# Altium project google-coral-baseboard.PrjPcb
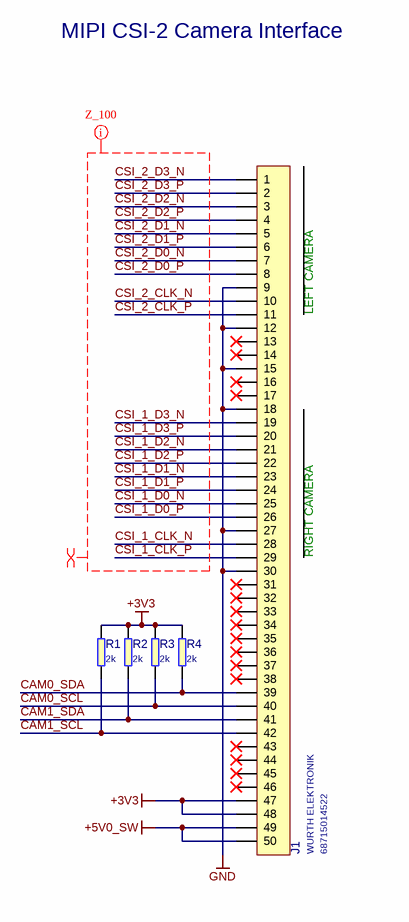
[diagram p0: CSI.SchDoc]
AM_Title: Google Coral Baseboard; AM_Status: OSHW; AM_Revision: 1.2
7 sheets, 284 parts. Net scope: global (net labels, ports and power ports of the same name join across sheets).
Board file: PCB.PcbDoc
Sheets:
  CSI.SchDoc
  Ethernet.SchDoc
  Interfaces.SchDoc
  M2.SchDoc
  SoM.SchDoc
  Supply.SchDoc
  USB-Debug.SchDoc

## Sheet CSI.SchDoc
size A3; SheetNumber: 1; SheetTotal: 1; PageSetup: Record=PageOptions|CenterHorizontal=True|CenterVertical=True|PrintScale=0.97|XCorrection=1.00|YCorrection=1.00|PrintKind=1|BorderSize=5000000|LeftOffset=0|BottomOffset=0|Orientation=2|PaperLength=2970|PaperWidth=2100|Scale=100|PaperSource=7|PrintQuality=600|MediaType=1|DitherType=10|PaperKind=A4|PrintScaleMode=1

### Parts
J1  68715014522  Manufacturer: WURTH ELEKTRONIK  [68715014522]
R1  2k  [0402]
R2  2k  [0402]
R3  2k  [0402]
R4  2k  [0402]

### Nets
+3V3: J1.47 J1.48 R1.1 R2.1 R3.1 R4.1
+5V0_SW: J1.49 J1.50
GND: J1.9 J1.12 J1.15 J1.18 J1.27 J1.30
CAM0_SCL: J1.40 R3.2
CAM0_SDA: J1.39 R4.2
CAM1_SCL: J1.42 R1.2
CAM1_SDA: J1.41 R2.2
CSI_1_CLK_N: J1.28
CSI_1_CLK_P: J1.29
CSI_1_D0_N: J1.25
CSI_1_D0_P: J1.26
CSI_1_D1_N: J1.23
CSI_1_D1_P: J1.24
CSI_1_D2_N: J1.21
CSI_1_D2_P: J1.22
CSI_1_D3_N: J1.19
CSI_1_D3_P: J1.20
CSI_2_CLK_N: J1.10
CSI_2_CLK_P: J1.11
CSI_2_D0_N: J1.7
CSI_2_D0_P: J1.8
CSI_2_D1_N: J1.5
CSI_2_D1_P: J1.6
CSI_2_D2_N: J1.3
CSI_2_D2_P: J1.4
CSI_2_D3_N: J1.1
CSI_2_D3_P: J1.2

Not connected (* = marked no-connect by the designer): J1 13* 14* 16* 17* 31* 32* 33* 34* 35* 36* 37* 38* 43* 44* 45* 46*

### Layout directives
net class Z_100: CSI_1_CLK_N, CSI_1_CLK_P, CSI_1_D0_N, CSI_1_D0_P, CSI_1_D1_N, CSI_1_D1_P, CSI_1_D2_N, CSI_1_D2_P, CSI_1_D3_N, CSI_1_D3_P, CSI_2_CLK_N, CSI_2_CLK_P, CSI_2_D0_N, CSI_2_D0_P, CSI_2_D1_N, CSI_2_D1_P, CSI_2_D2_N, CSI_2_D2_P, CSI_2_D3_N, CSI_2_D3_P
differential pair: CSI_1_CLK_N, CSI_1_CLK_P, CSI_1_D0_N, CSI_1_D0_P, CSI_1_D1_N, CSI_1_D1_P, CSI_1_D2_N, CSI_1_D2_P, CSI_1_D3_N, CSI_1_D3_P, CSI_2_CLK_N, CSI_2_CLK_P, CSI_2_D0_N, CSI_2_D0_P, CSI_2_D1_N, CSI_2_D1_P, CSI_2_D2_N, CSI_2_D2_P, CSI_2_D3_N, CSI_2_D3_P

### Notes on the sheet
- MIPI CSI-2 Camera Interface
- (near J1) LEFT CAMERA
- (near J1) RIGHT CAMERA
- Title:
- Size:
- Date:
- Status:
- A3
- Revision:
- Page:
- of
- Antmicro Ltd
- www.antmicro.com
- File:

### Library data of the parts
J1 = WE-687-150-145-22: 0.50mm SMT ZIF Horizontal Bottom Contact WR-FPC; Value: 68715014522; PartNumber: 68715014522
R1-R4 = R_2k_0402: SMT Resistor 2k 0402; PartNumber: R_2k_0402; Value: 2k

## Sheet Ethernet.SchDoc
size A3; SheetNumber: 1; SheetTotal: 1; PageSetup: Record=PageOptions|CenterHorizontal=True|CenterVertical=True|PrintScale=0.97|XCorrection=1.00|YCorrection=1.00|PrintKind=1|BorderSize=5000000|LeftOffset=0|BottomOffset=0|Orientation=2|PaperLength=2970|PaperWidth=2100|Scale=100|PaperSource=7|PrintQuality=600|MediaType=1|DitherType=10|PaperKind=A4|PrintScaleMode=1
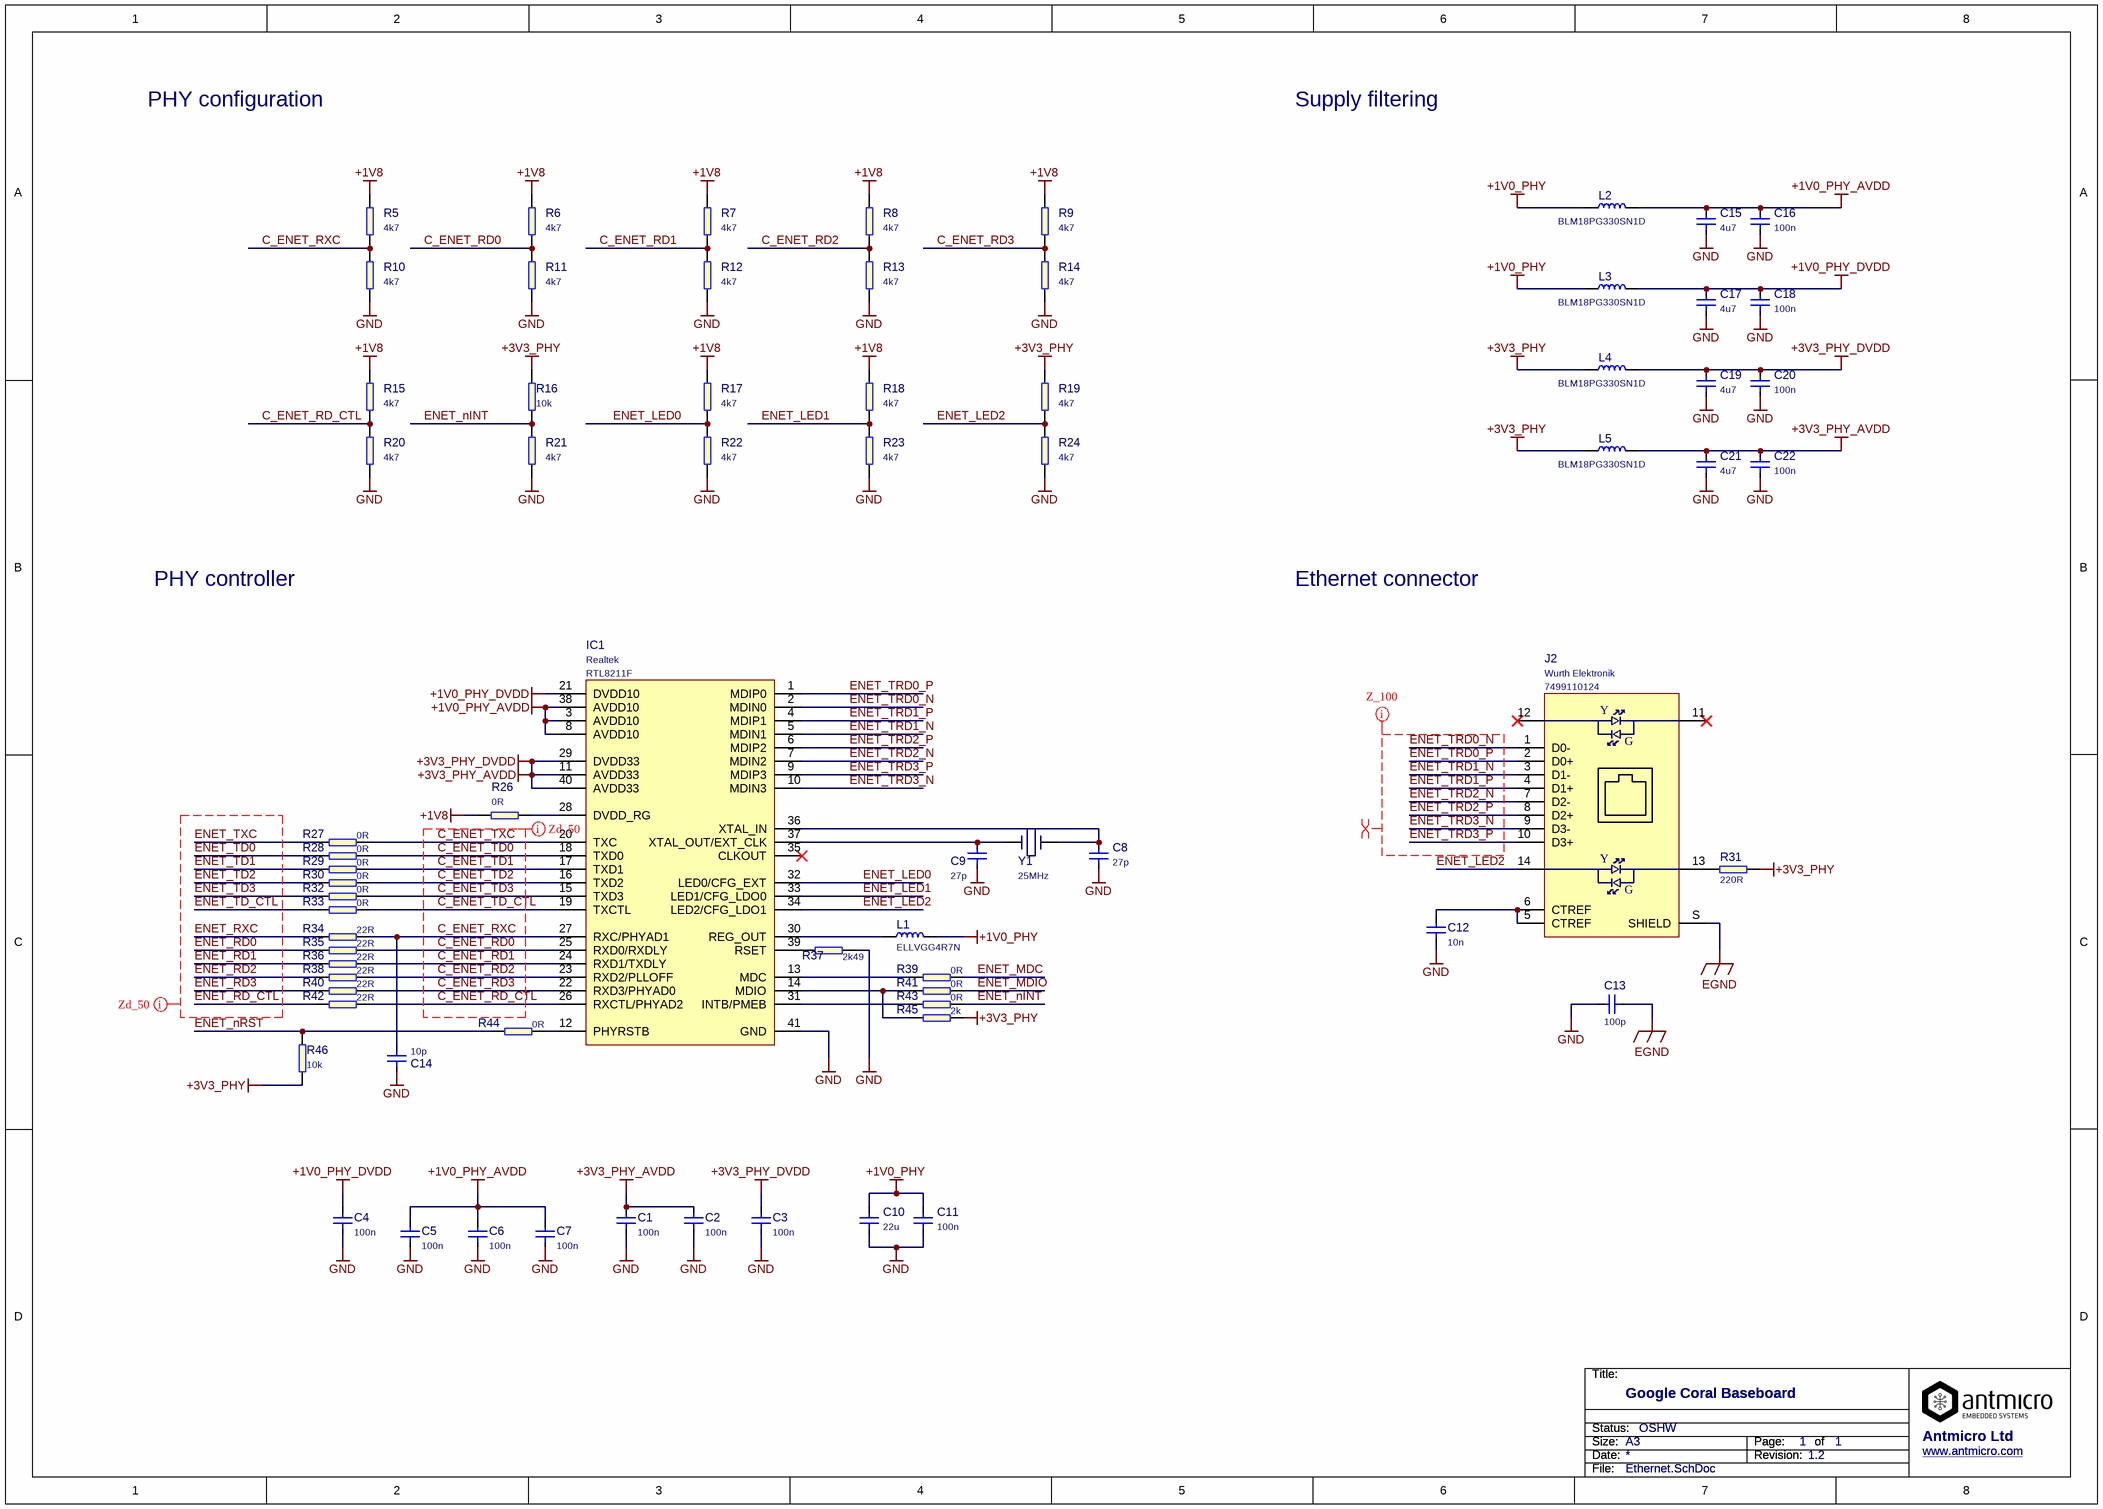
[diagram p1: Ethernet.SchDoc]

### Parts
C1  100n  [C_0402]
C2  100n  [C_0402]
C3  100n  [C_0402]
C4  100n  [C_0402]
C5  100n  [C_0402]
C6  100n  [C_0402]
C7  100n  [C_0402]
C8  27p  [C_0402]
C9  27p  [C_0402]
C10  22u  [1210]
C11  100n  [C_0402]
C12  10n  [0603]
C13  100p  [0603]
C14  10p  [C_0402]
C15  4u7  [0603]
C16  100n  [C_0402]
C17  4u7  [0603]
C18  100n  [C_0402]
C19  4u7  [0603]
C20  100n  [C_0402]
C21  4u7  [0603]
C22  100n  [C_0402]
IC1  RTL8211F  Manufacturer: Realtek  [RTL8211F]
J2  Manufacturer: Wurth Elektronik  [WE_7499110124]  (hidden comment: 7499110124)
L1  ELLVGG4R7N  [ELLVGG4R7N]
L2  BLM18PG330SN1D  [0603]
L3  BLM18PG330SN1D  [0603]
L4  BLM18PG330SN1D  [0603]
L5  BLM18PG330SN1D  [0603]
R5  4k7  [0402]
R6  4k7  [0402]
R7  4k7  [0402]
R8  4k7  [0402]
R9  4k7  [0402]
R10  4k7  [0402]
R11  4k7  [0402]
R12  4k7  [0402]
R13  4k7  [0402]
R14  4k7  [0402]
R15  4k7  [0402]
R16  10k  [0402]
R17  4k7  [0402]
R18  4k7  [0402]
R19  4k7  [0402]
R20  4k7  [0402]
R21  4k7  [0402]
R22  4k7  [0402]
R23  4k7  [0402]
R24  4k7  [0402]
R26  0R  [0402]
R27  0R  [0402]
R28  0R  [0402]
R29  0R  [0402]
R30  0R  [0402]
R31  220R  [0402]
R32  0R  [0402]
R33  0R  [0402]
R34  22R  [0402]
R35  22R  [0402]
R36  22R  [0402]
R37  2k49  [0603]
R38  22R  [0402]
R39  0R  [0402]
R40  22R  [0402]
R41  0R  [0402]
R42  22R  [0402]
R43  0R  [0402]
R44  0R  [0402]
R45  2k  [0402]
R46  10k  [0402]
Y1  25MHz  [TXC_7A]

### Nets
+1V0_PHY: C10.2 C11.2 L1.2 L2.1 L3.1
+1V0_PHY_AVDD: C5.2 C6.2 C7.2 C15.2 C16.2 IC1.3(AVDD10) IC1.8(AVDD10) IC1.38(AVDD10) L2.2
+1V0_PHY_DVDD: C4.2 C17.2 C18.2 IC1.21(DVDD10) L3.2
+1V8: R5.2 R6.2 R7.2 R8.2 R9.2 R15.2 R17.2 R18.2 R26.1
+3V3_PHY: L4.1 L5.1 R16.2 R19.2 R31.2 R45.2 R46.1
+3V3_PHY_AVDD: C1.2 C2.2 C3.2 C19.2 C20.2 C21.2 C22.2 IC1.11(AVDD33) IC1.29(DVDD33) IC1.40(AVDD33) L4.2 L5.2  [also labelled +3V3_PHY_DVDD]
EGND: C13.1 J2.S(SHIELD)
GND: C1.1 C2.1 C3.1 C4.1 C5.1 C6.1 C7.1 C8.1 C9.1 C10.1 C11.1 C12.1 C13.2 C14.1 C15.1 C16.1 C17.1 C18.1 C19.1 C20.1 C21.1 C22.1 IC1.41(GND) R10.1 R11.1 R12.1 R13.1 R14.1 R20.1 R21.1 R22.1 R23.1 R24.1 R37.2
C_ENET_RD0: IC1.25(RXD0/RXDLY) R6.1 R11.2 R35.2
C_ENET_RD1: IC1.24(RXD1/TXDLY) R7.1 R12.2 R36.2
C_ENET_RD2: IC1.23(RXD2/PLLOFF) R8.1 R13.2 R38.2
C_ENET_RD3: IC1.22(RXD3/PHYAD0) R9.1 R14.2 R40.2
C_ENET_RD_CTL: IC1.26(RXCTL/PHYAD2) R15.1 R20.2 R42.2
C_ENET_RXC: C14.2 IC1.27(RXC/PHYAD1) R5.1 R10.2 R34.2
C_ENET_TD0: IC1.18(TXD0) R28.2
C_ENET_TD1: IC1.17(TXD1) R29.2
C_ENET_TD2: IC1.16(TXD2) R30.2
C_ENET_TD3: IC1.15(TXD3) R32.2
C_ENET_TD_CTL: IC1.19(TXCTL) R33.2
C_ENET_TXC: IC1.20(TXC) R27.2
ENET_LED0: IC1.32(LED0/CFG_EXT) R17.1 R22.2
ENET_LED1: IC1.33(LED1/CFG_LDO0) R18.1 R23.2
ENET_LED2: IC1.34(LED2/CFG_LDO1) J2.14 R19.1 R24.2
ENET_MDC: R39.2
ENET_MDIO: R41.2
ENET_nINT: R16.1 R21.2 R43.2
ENET_nRST: R44.1 R46.2
ENET_RD0: R35.1
ENET_RD1: R36.1
ENET_RD2: R38.1
ENET_RD3: R40.1
ENET_RD_CTL: R42.1
ENET_RXC: R34.1
ENET_TD0: R28.1
ENET_TD1: R29.1
ENET_TD2: R30.1
ENET_TD3: R32.1
ENET_TD_CTL: R33.1
ENET_TRD0_N: IC1.2(MDIN0) J2.1(D0-)
ENET_TRD0_P: IC1.1(MDIP0) J2.2(D0+)
ENET_TRD1_N: IC1.5(MDIN1) J2.3(D1-)
ENET_TRD1_P: IC1.4(MDIP1) J2.4(D1+)
ENET_TRD2_N: IC1.7(MDIN2) J2.7(D2-)
ENET_TRD2_P: IC1.6(MDIP2) J2.8(D2+)
ENET_TRD3_N: IC1.10(MDIN3) J2.9(D3-)
ENET_TRD3_P: IC1.9(MDIP3) J2.10(D3+)
ENET_TXC: R27.1
NetC8_2: C8.2 IC1.36(XTAL_IN) Y1.2
NetC9_2: C9.2 IC1.37(XTAL_OUT/EXT_CLK) Y1.1
NetC12_2: C12.2 J2.5(CTREF) J2.6(CTREF)
NetIC1_12: IC1.12(PHYRSTB) R44.2
NetIC1_13: IC1.13(MDC) R39.1
NetIC1_14: IC1.14(MDIO) R41.1 R45.1
NetIC1_28: IC1.28(DVDD_RG) R26.2
NetIC1_30: IC1.30(REG_OUT) L1.1
NetIC1_31: IC1.31(INTB/PMEB) R43.1
NetIC1_39: IC1.39(RSET) R37.1
NetJ2_13: J2.13 R31.1

Not connected (* = marked no-connect by the designer): IC1 35(CLKOUT)*; J2 11* 12*

### Layout directives
net class Z_100: ENET_TRD0_N, ENET_TRD0_P, ENET_TRD1_N, ENET_TRD1_P, ENET_TRD2_N, ENET_TRD2_P, ENET_TRD3_N, ENET_TRD3_P
differential pair: ENET_TRD0_N, ENET_TRD0_P, ENET_TRD1_N, ENET_TRD1_P, ENET_TRD2_N, ENET_TRD2_P, ENET_TRD3_N, ENET_TRD3_P
net class Z_50: C_ENET_RD0, C_ENET_RD1, C_ENET_RD2, C_ENET_RD3, C_ENET_RD_CTL, C_ENET_RXC, C_ENET_TD0, C_ENET_TD1, C_ENET_TD2, C_ENET_TD3, C_ENET_TD_CTL, C_ENET_TXC, ENET_RD0, ENET_RD1, ENET_RD2, ENET_RD3, ENET_RD_CTL, ENET_RXC, ENET_TD0, ENET_TD1, ENET_TD2, ENET_TD3, ENET_TD_CTL, ENET_TXC

### Notes on the sheet
- PHY configuration
- Supply filtering
- PHY controller
- Ethernet connector
- Title:
- Size:
- Date:
- Status:
- A3
- Revision:
- Page:
- of
- Antmicro Ltd
- www.antmicro.com
- File:
- (in symbol WE_7499110124) Y; G

### Library data of the parts
C1-C7 C11 C16 C18 C20 C22 = C_100n_0402: MLCC SMT Capacitor 100nF 0402; PartNumber: C_100n_0402; Value: 100n
C8 C9 = C_27p_0402: MLCC SMT Capacitor 27pF 0402; PartNumber: C_27p_0402; Value: 27p
C10 = C_22u_1210: MLCC SMT Capacitor 22uF 1210; PartNumber: C_22u_1210; Value: 22u
C12 = C_10n_0603: MLCC SMT Capacitor 10nF 0603; PartNumber: C_10n_0603; Value: 10n
C13 = C_100p_0603: MLCC SMT Capacitor 100pF 0603; PartNumber: C_100p_0603; Value: 100p
C14 = C_10p_0402: MLCC SMT Capacitor 10pF 0402; PartNumber: C_10p_0402; Value: 10p
C15 C17 C19 C21 = C_4u7_0603: MLCC SMT Capacitor 4u7F 0603; PartNumber: C_4u7_0603; Value: 4u7
IC1 = RTL8211F: Highly Integrated 10/100/1000m Ethernet Transceiver; PartNumber: RTL8211F; Value: RTL8211F
J2 = WE_7499110124: LAN-Transformer WE-RJ45LAN 10/100/1000 BaseT; PartNumber: 7499110124; Value: 7499110124
L1 = ELLVGG4R7N: PANASONIC ELECTRONIC COMPONENTS  ELLVGG4R7N  Surface Mount Power Inductor, Choke Coil, ELL-VGG Series, 4.7 ?H, ? 30%, Shielded, 0.17 ohm, 980 mA; Manufacturer: PANASONIC ELECTRONIC COMPONENTS / ELLVGG4R7N / PANASONIC ELECTRONIC COMPONENTS; PartNumber: ELLVGG4R7N; Value: ELLVGG4R7N
L2-L5 = BLM18PG330SN1D: MURATA 	BLM18PG330SN1D  FERRITE BEAD, 0.025OHM, 3A, 0603; Value: BLM18PG330SN1D; Manufacturer: MURATA; PartNumber: BLM18PG330SN1D
R5-R15 R17-R24 = R_4k7_0402: SMT Resistor 4k7 0402; PartNumber: R_4k7_0402; Value: 4k7
R16 R46 = R_10k_0402: SMT Resistor 0402; PartNumber: R_10k_0402; Value: 10k
R26-R30 R32 R33 R39 R41 R43 R44 = R_0R_0402: SMT Resistor 0402; PartNumber: R_0R_0402; Value: 0R
R31 = R_220R_0402: SMT Resistor 220R 0402; PartNumber: R_220R_0402; Value: 220R
R34-R36 R38 R40 R42 = R_22R_0402: SMT Resistor 22R 0402; PartNumber: R_22R_0402; Value: 22R
R37 = R_2k49_0603_1%: SMT Resistor 2k49 0603 1%; PartNumber: R_2k49_0603_1%; Value: 2k49
R45 = R_2k_0402: SMT Resistor 2k 0402; PartNumber: R_2k_0402; Value: 2k
Y1 = CRYSTAL_25MHz_SMD_TXC: CRYSTAL, 25.000MHZ; Manufacturer: TXC; Value: 25MHz; PartNumber: CRYSTAL_25MHz_SMD_TXC

## Sheet Interfaces.SchDoc
size A3; SheetNumber: 1; SheetTotal: 1; PageSetup: Record=PageOptions|CenterHorizontal=True|CenterVertical=True|PrintScale=0.97|XCorrection=1.00|YCorrection=1.00|PrintKind=1|BorderSize=5000000|LeftOffset=0|BottomOffset=0|Orientation=2|PaperLength=2970|PaperWidth=2100|Scale=100|PaperSource=7|PrintQuality=600|MediaType=1|DitherType=10|PaperKind=A4|PrintScaleMode=1
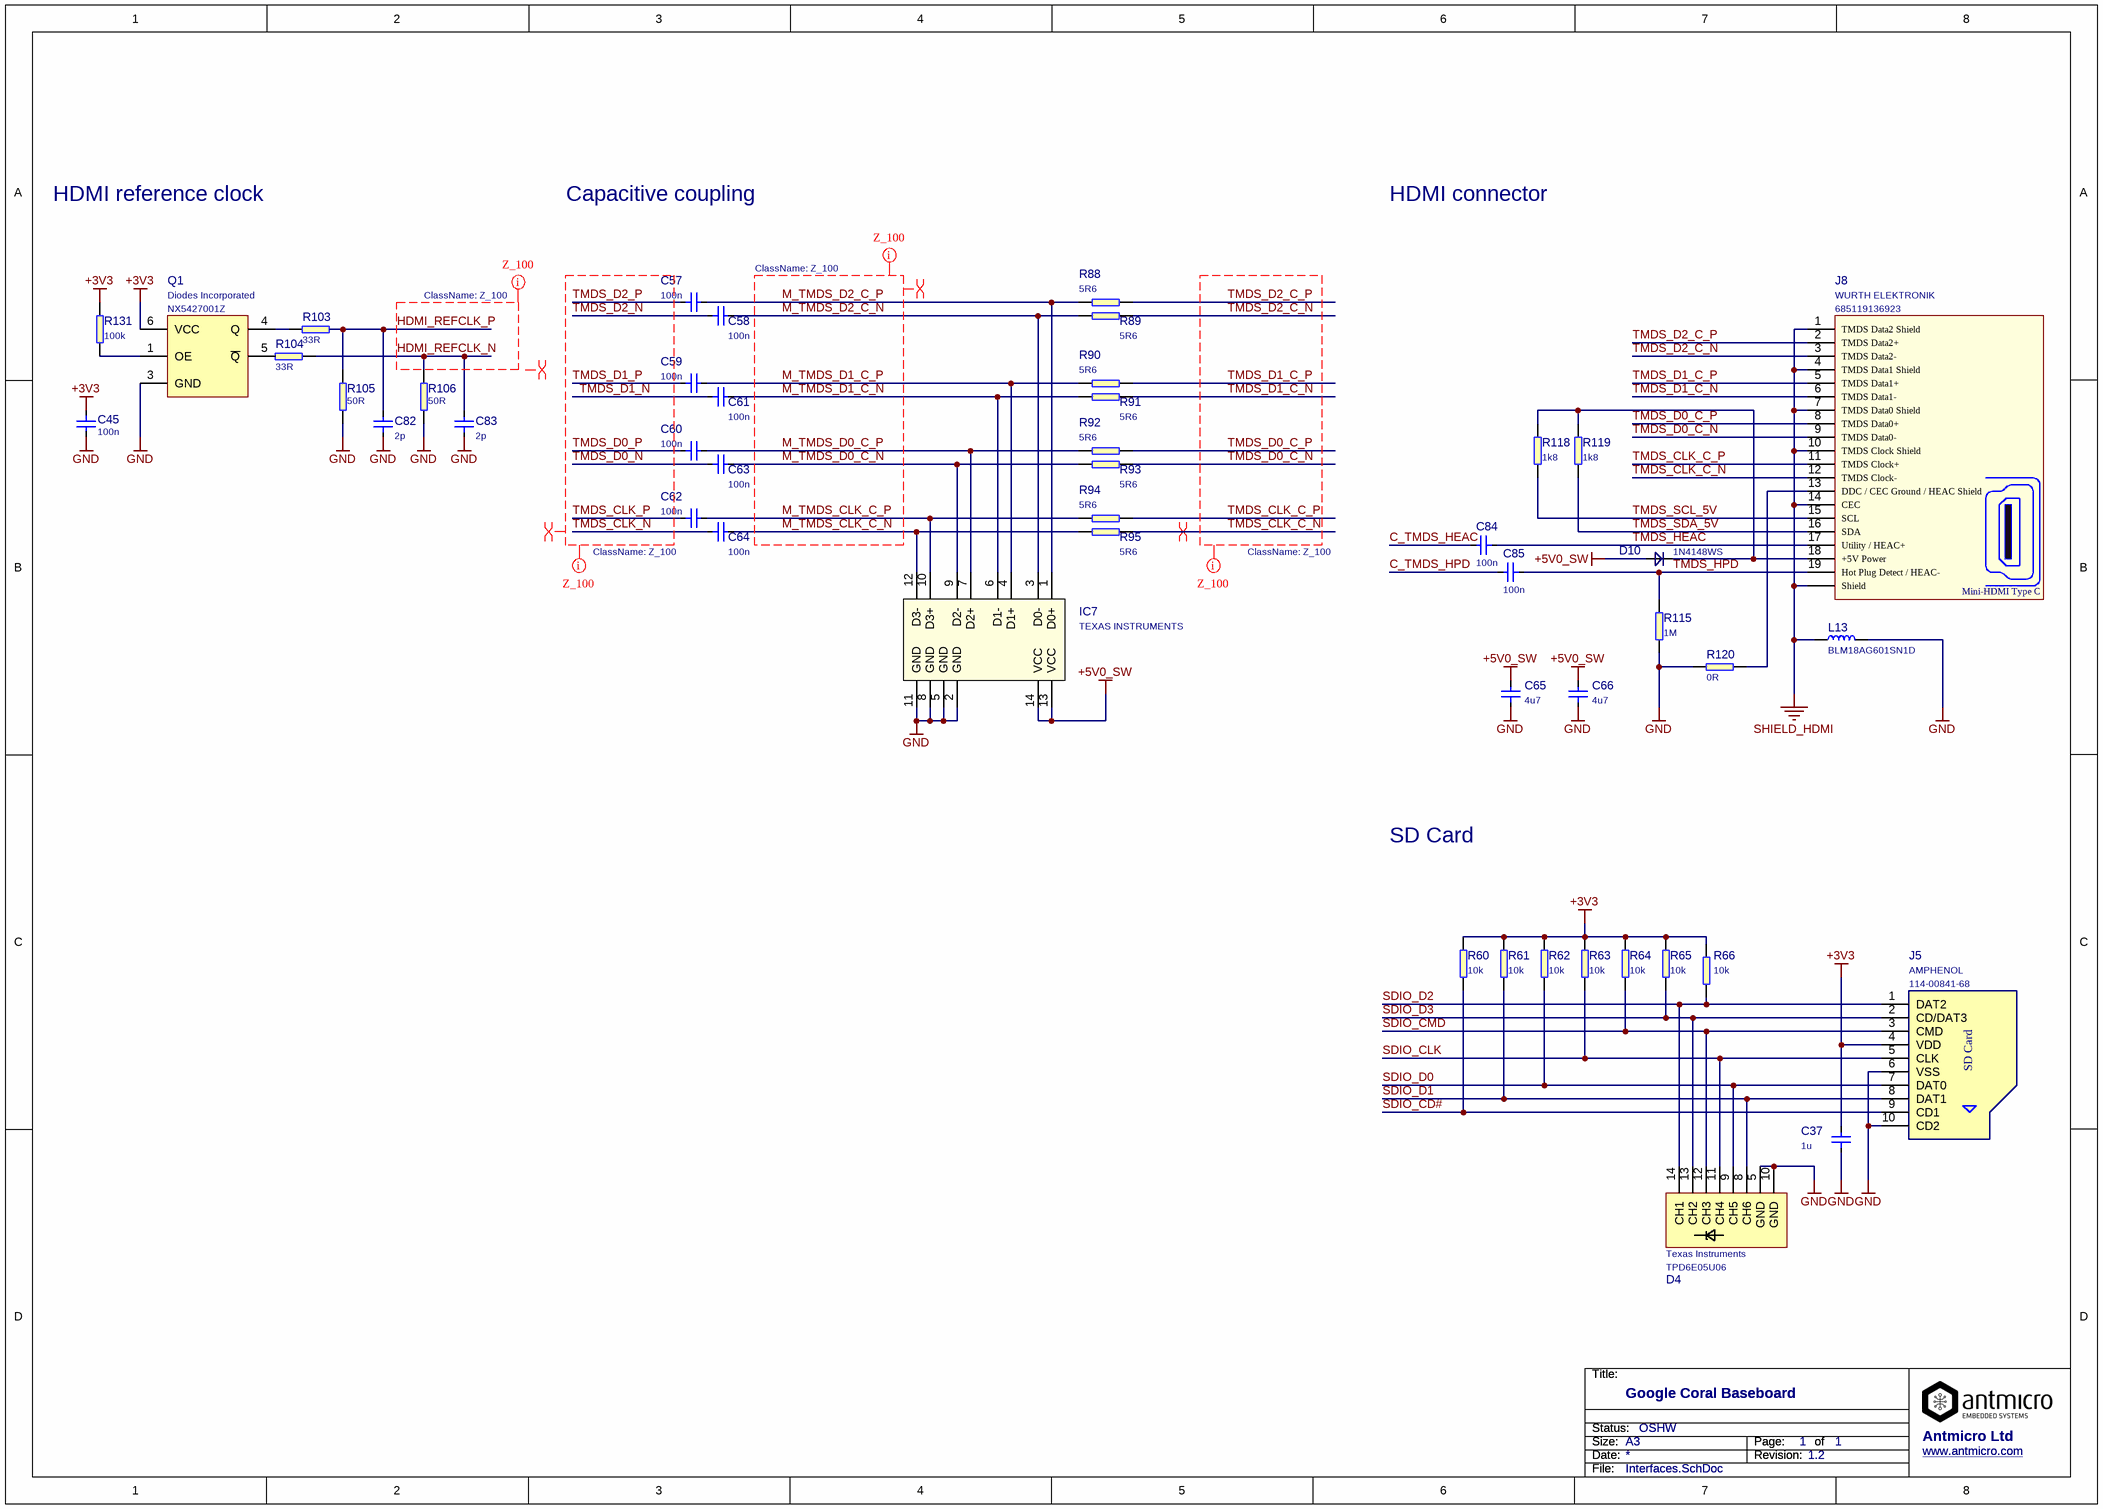
[diagram p2: Interfaces.SchDoc]

### Parts
C37  1u  [0603]
C45  100n  [C_0402]
C57  100n  [C_0402]
C58  100n  [C_0402]
C59  100n  [C_0402]
C60  100n  [C_0402]
C61  100n  [C_0402]
C62  100n  [C_0402]
C63  100n  [C_0402]
C64  100n  [C_0402]
C65  4u7  [C_0402]
C66  4u7  [C_0402]
C82  2p  [C_0402]
C83  2p  [C_0402]
C84  100n  [C_0402]
C85  100n  [C_0402]
D4  Manufacturer: Texas Instruments  [TPD6E05U06_PASS]  (hidden comment: TPD6E05U06)
D10  1N4148WS  [SOD-323]
IC7  Manufacturer: TEXAS INSTRUMENTS  [SON-15]  (hidden comment: TPD8S009)
J5  Manufacturer: AMPHENOL  [114-00841-68]  (hidden comment: 114-00841-68)
J8  685119136923  Manufacturer: WURTH ELEKTRONIK  [WE_685119136923]
L13  BLM18AG601SN1D  [0603]
Q1  Manufacturer: Diodes Incorporated  [NX5427001Z]  (hidden comment: NX5427001Z)
R60  10k  [0402]
R61  10k  [0402]
R62  10k  [0402]
R63  10k  [0402]
R64  10k  [0402]
R65  10k  [0402]
R66  10k  [0402]
R88  5R6  [0402]
R89  5R6  [0402]
R90  5R6  [0402]
R91  5R6  [0402]
R92  5R6  [0402]
R93  5R6  [0402]
R94  5R6  [0402]
R95  5R6  [0402]
R103  33R  [0402]
R104  33R  [0402]
R105  50R  [0402]
R106  50R  [0402]
R115  1M  [0402]
R118  1k8  [0603]
R119  1k8  [0603]
R120  0R  [0402]
R131  100k  [0402]

### Nets
+3V3: C37.2 C45.1 J5.4(VDD) Q1.6(VCC) R60.2 R61.2 R62.2 R63.2 R64.2 R65.2 R66.2 R131.2
+5V0_SW: C65.2 C66.2 D10.A IC7.13(VCC) IC7.14(VCC)
GND: C37.1 C45.2 C65.1 C66.1 C82.1 C83.1 D4.5(GND) D4.10(GND) IC7.2(GND) IC7.5(GND) IC7.8(GND) IC7.11(GND) J5.6(VSS) J5.10(CD2) L13.2 Q1.3(GND) R105.1 R106.1 R115.1 R120.1
SHIELD_HDMI: J8.1(TMDS_Data2_Shield) J8.4(TMDS_Data1_Shield) J8.7(TMDS_Data0_Shield) J8.10(TMDS_Clock_Shield) J8.14(CEC) J8.Shell(Shield) L13.1
C_TMDS_HEAC: C84.2
C_TMDS_HPD: C85.2
HDMI_REFCLK_N: C83.2 R104.2 R106.2
HDMI_REFCLK_P: C82.2 R103.2 R105.2
M_TMDS_CLK_C_N: C64.2 IC7.12(D3-) R95.1
M_TMDS_CLK_C_P: C62.2 IC7.10(D3+) R94.1
M_TMDS_D0_C_N: C63.2 IC7.9(D2-) R93.1
M_TMDS_D0_C_P: C60.2 IC7.7(D2+) R92.1
M_TMDS_D1_C_N: C61.2 IC7.6(D1-) R91.1
M_TMDS_D1_C_P: C59.2 IC7.4(D1+) R90.1
M_TMDS_D2_C_N: C58.2 IC7.3(D0-) R89.1
M_TMDS_D2_C_P: C57.2 IC7.1(D0+) R88.1
SDIO_CD#: J5.9(CD1) R60.1
SDIO_CLK: D4.11(CH4) J5.5(CLK) R63.1
SDIO_CMD: D4.12(CH3) J5.3(CMD) R64.1
SDIO_D0: D4.9(CH5) J5.7(DAT0) R62.1
SDIO_D1: D4.8(CH6) J5.8(DAT1) R61.1
SDIO_D2: D4.14(CH1) J5.1(DAT2) R66.1
SDIO_D3: D4.13(CH2) J5.2(CD/DAT3) R65.1
TMDS_CLK_C_N: J8.12(TMDS_Clock-) R95.2
TMDS_CLK_C_P: J8.11(TMDS_Clock+) R94.2
TMDS_CLK_N: C64.1
TMDS_CLK_P: C62.1
TMDS_D0_C_N: J8.9(TMDS_Data0-) R93.2
TMDS_D0_C_P: J8.8(TMDS_Data0+) R92.2
TMDS_D0_N: C63.1
TMDS_D0_P: C60.1
TMDS_D1_C_N: J8.6(TMDS_Data1-) R91.2
TMDS_D1_C_P: J8.5(TMDS_Data1+) R90.2
TMDS_D1_N: C61.1
TMDS_D1_P: C59.1
TMDS_D2_C_N: J8.3(TMDS_Data2-) R89.2
TMDS_D2_C_P: J8.2(TMDS_Data2+) R88.2
TMDS_D2_N: C58.1
TMDS_D2_P: C57.1
TMDS_HEAC: C84.1 J8.17(Utility_/_HEAC+)
TMDS_HPD: C85.1 J8.19(Hot_Plug_Detect_/_HEAC-) R115.2
TMDS_SCL_5V: J8.15(SCL) R118.1
TMDS_SDA_5V: J8.16(SDA) R119.1
NetD10_C: D10.C J8.18(+5V_Power) R118.2 R119.2
NetJ8_13: J8.13(DDC_/_CEC_Ground_/_HEAC_Shield) R120.2
NetQ1_1: Q1.1(OE) R131.1
NetQ1_4: Q1.4(Q) R103.1
NetQ1_5: Q1.5(~{Q}) R104.1

### Layout directives
net class Z_100: HDMI_REFCLK_N, HDMI_REFCLK_P, M_TMDS_CLK_C_N, M_TMDS_CLK_C_P, M_TMDS_D0_C_N, M_TMDS_D0_C_P, M_TMDS_D1_C_N, M_TMDS_D1_C_P, M_TMDS_D2_C_N, M_TMDS_D2_C_P, TMDS_CLK_C_N, TMDS_CLK_C_P, TMDS_CLK_N, TMDS_CLK_P, TMDS_D0_C_N, TMDS_D0_C_P, TMDS_D0_N, TMDS_D0_P, TMDS_D1_C_N, TMDS_D1_C_P, TMDS_D1_N, TMDS_D1_P, TMDS_D2_C_N, TMDS_D2_C_P, TMDS_D2_N, TMDS_D2_P
differential pair: (no net found under the mark), M_TMDS_CLK_C_N, M_TMDS_CLK_C_P, M_TMDS_D0_C_N, M_TMDS_D0_C_P, M_TMDS_D1_C_N, M_TMDS_D1_C_P, M_TMDS_D2_C_N, M_TMDS_D2_C_P, TMDS_CLK_C_N, TMDS_CLK_N, TMDS_CLK_P, TMDS_D0_N, TMDS_D0_P, TMDS_D1_N, TMDS_D1_P, TMDS_D2_N, TMDS_D2_P

### Notes on the sheet
- HDMI reference clock
- Capacitive coupling
- HDMI connector
- SD Card
- Title:
- Size:
- Date:
- Status:
- A3
- Revision:
- Page:
- of
- Antmicro Ltd
- www.antmicro.com
- File:
- (in symbol AMP-114-00841-68) SD Card
- (in symbol WE_685119136923) Mini-HDMI Type C

### Library data of the parts
C37 = C_1u_0603: MLCC SMT Capacitor 1uF 0603; Value: 1u; PartNumber: C_1u_0603
C45 C57-C64 C84 C85 = C_100n_0402: MLCC SMT Capacitor 100nF 0402; PartNumber: C_100n_0402; Value: 100n
C65 C66 = C_4u7_0402: MLCC SMT Capacitor 4u7F 0402; PartNumber: C_4u7_0402; Value: 4u7
C82 C83 = C_2p_0402: MLCC SMT Capacitor 2p 0402; PartNumber: C_2p_0402; Value: 2p
D4 = TPD6E05U06_PASS: ESD Suppressors 6-CH Pass through layout; Value: TPD6E05U06; PartNumber: TPD6E05U06
D10 = 1N4148WS: Diode small signal; Manufacturer: MULTICOMP; Value: 1N4148WS; PartNumber: 1N4148WS
IC7 = TPD8S009: 8-Channel ESD Protection for DisplayPort and HDMI; PartNumber: TPD8S009; Value: TPD8S009
J5 = AMP-114-00841-68: Micro SD card holder; Value: 114-00841-68; PartNumber: 114-00841-68
J8 = WE_685119136923: CONN HDMI FEMALE R/A 19POS 2.6MM; PartNumber: WE_685119136923; Value: 685119136923
L13 = BLM18AG601SN1D: Ferrite Bead, 600 ohm, 0603 [1608 Metric], BLM18A Series, 500 mA, 0.38 ohm, ? 25%; Manufacturer: MURATA; PartNumber: BLM18AG601SN1D; Value: BLM18AG601SN1D
Q1 = NX5427001Z: CLOCK SAW OSCILLATOR SEAM5032; PartNumber: NX5427001Z; Value: NX5427001Z
R60-R66 = R_10k_0402: SMT Resistor 0402; Value: 10k; PartNumber: R_10k_0402
R88-R95 = R_5R6_0402: SMD Resistor 0402; PartNumber: R_5R6_0402; Value: 5R6
R103 R104 = R_33R_0402: RES, 33R, 0402, 1%; PartNumber: R_33R_0402; Value: 33R
R105 R106 = R_33R_0402: RES, 33R, 0402, 1%; PartNumber: R_50R_0402; Value: 50R
R115 = R_1M_0402: SMT Resistor 1M 0402; PartNumber: R_1M_0402; Value: 1M
R118 R119 = R_1k8_0603: SMT Resistor 1k8 0603; PartNumber: R_1k8_0603; Value: 1k8
R120 = R_0R_0402: SMT Resistor 0402; PartNumber: R_0R_0402; Value: 0R
R131 = R_100k_0402: SMT Resistor 100k 0402; PartNumber: R_100k_0402; Value: 100k

## Sheet M2.SchDoc
size A3; SheetNumber: 1; SheetTotal: 1; PageSetup: Record=PageOptions|CenterHorizontal=True|CenterVertical=True|PrintScale=0.97|XCorrection=1.00|YCorrection=1.00|PrintKind=1|BorderSize=5000000|LeftOffset=0|BottomOffset=0|Orientation=2|PaperLength=2970|PaperWidth=2100|Scale=100|PaperSource=7|PrintQuality=600|MediaType=1|DitherType=10|PaperKind=A4|PrintScaleMode=1
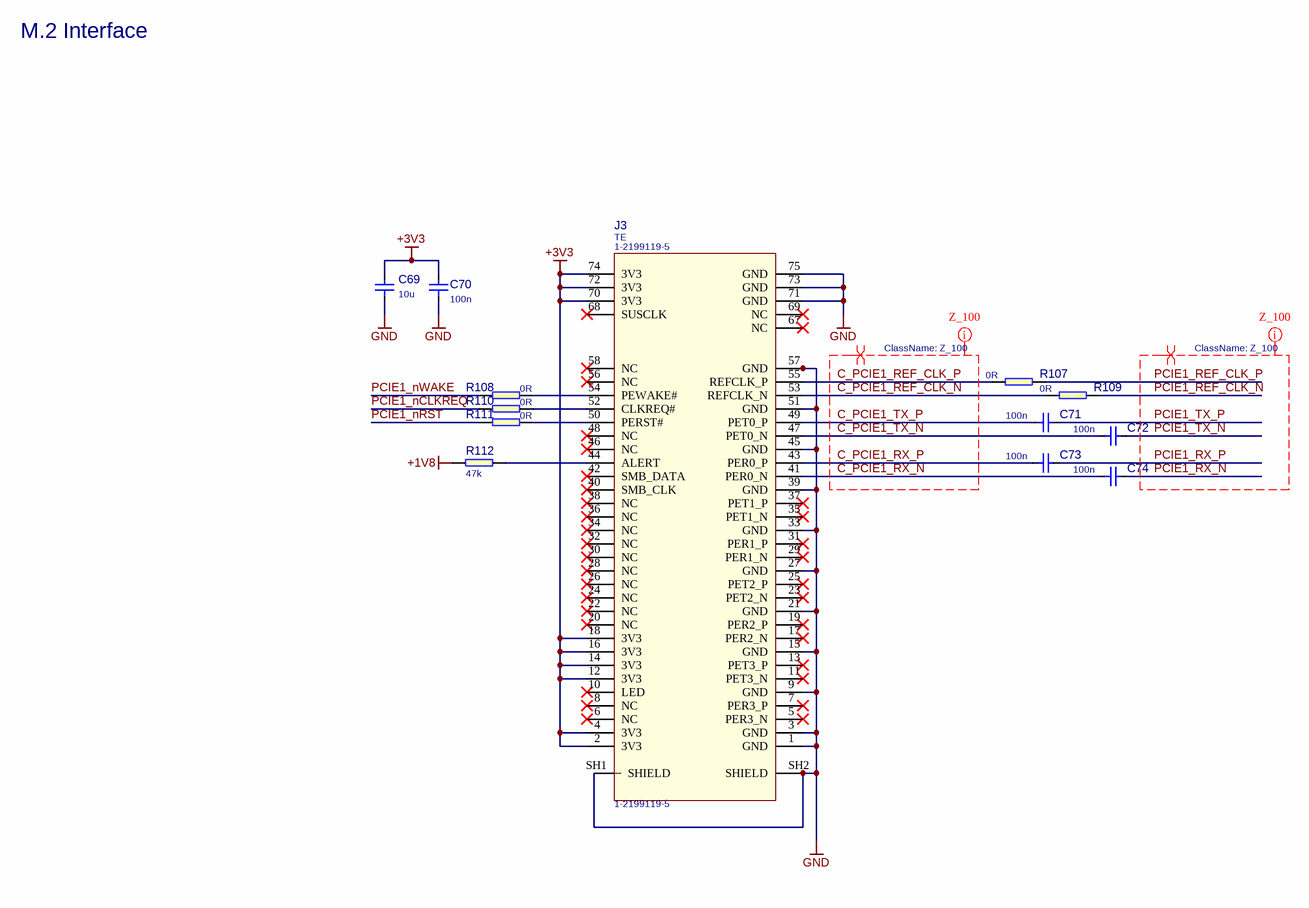
[diagram p3: M2.SchDoc]

### Parts
C69  10u  [0805]
C70  100n  [C_0402]
C71  100n  [C_0402]
C72  100n  [C_0402]
C73  100n  [C_0402]
C74  100n  [C_0402]
J3  1-2199119-5  Manufacturer: TE  [1-2199119-5]
R107  0R  [0402]
R108  0R  [0402]
R109  0R  [0402]
R110  0R  [0402]
R111  0R  [0402]
R112  47k  [0402]

### Nets
+1V8: R112.2
+3V3: C69.2 C70.2 J3.2(3V3) J3.4(3V3) J3.12(3V3) J3.14(3V3) J3.16(3V3) J3.18(3V3) J3.70(3V3) J3.72(3V3) J3.74(3V3)
GND: C69.1 C70.1 J3.1(GND) J3.3(GND) J3.9(GND) J3.15(GND) J3.21(GND) J3.27(GND) J3.33(GND) J3.39(GND) J3.45(GND) J3.51(GND) J3.57(GND) J3.71(GND) J3.73(GND) J3.75(GND) J3.SH1(SHIELD) J3.SH2(SHIELD)
C_PCIE1_REF_CLK_N: J3.53(REFCLK_N) R109.1
C_PCIE1_REF_CLK_P: J3.55(REFCLK_P) R107.1
C_PCIE1_RX_N: C74.1 J3.41(PER0_N)
C_PCIE1_RX_P: C73.1 J3.43(PER0_P)
C_PCIE1_TX_N: C72.1 J3.47(PET0_N)
C_PCIE1_TX_P: C71.1 J3.49(PET0_P)
PCIE1_nCLKREQ: R110.1
PCIE1_nRST: R111.1
PCIE1_nWAKE: R108.1
PCIE1_REF_CLK_N: R109.2
PCIE1_REF_CLK_P: R107.2
PCIE1_RX_N: C74.2
PCIE1_RX_P: C73.2
PCIE1_TX_N: C72.2
PCIE1_TX_P: C71.2
NetJ3_44: J3.44(ALERT) R112.1
NetJ3_50: J3.50(PERST#) R111.2
NetJ3_52: J3.52(CLKREQ#) R110.2
NetJ3_54: J3.54(PEWAKE#) R108.2

Not connected (* = marked no-connect by the designer): J3 5(PER3_N)* 6(NC)* 7(PER3_P)* 8(NC)* 10(LED)* 11(PET3_N)* 13(PET3_P)* 17(PER2_N)* 19(PER2_P)* 20(NC)* 22(NC)* 23(PET2_N)* 24(NC)* 25(PET2_P)* 26(NC)* 28(NC)* 29(PER1_N)* 30(NC)* 31(PER1_P)* 32(NC)* 34(NC)* 35(PET1_N)* 36(NC)* 37(PET1_P)* 38(NC)* 40(SMB_CLK)* 42(SMB_DATA)* 46(NC)* 48(NC)* 56(NC)* 58(NC)* 67(NC)* 68(SUSCLK)* 69(NC)*

### Layout directives
net class Z_100: C_PCIE1_REF_CLK_N, C_PCIE1_REF_CLK_P, C_PCIE1_RX_N, C_PCIE1_RX_P, C_PCIE1_TX_N, C_PCIE1_TX_P, PCIE1_REF_CLK_N, PCIE1_REF_CLK_P, PCIE1_RX_N, PCIE1_RX_P, PCIE1_TX_N, PCIE1_TX_P
differential pair: C_PCIE1_REF_CLK_N, C_PCIE1_REF_CLK_P, C_PCIE1_RX_N, C_PCIE1_RX_P, C_PCIE1_TX_N, C_PCIE1_TX_P, PCIE1_REF_CLK_N, PCIE1_REF_CLK_P, PCIE1_RX_N, PCIE1_RX_P, PCIE1_TX_N, PCIE1_TX_P

### Notes on the sheet
- M.2 Interface
- Title:
- Size:
- Date:
- Status:
- A3
- Revision:
- Page:
- of
- Antmicro Ltd
- www.antmicro.com
- File:

### Library data of the parts
C69 = C_10u_0805: MLCC SMT Capacitor 10uF 0805; PartNumber: C_10u_0805; Value: 10u
C70-C74 = C_100n_0402: MLCC SMT Capacitor 100nF 0402; PartNumber: C_100n_0402; Value: 100n
J3 = 1-2199119-5: CONN FEMALE 67POS 0.020 GOLD; PartNumber: 1-2199119-5; Value: 1-2199119-5
R107-R111 = R_0R_0402: SMT Resistor 0402; PartNumber: R_0R_0402; Value: 0R
R112 = R_47k_0402: SMT Resistor 0402; PartNumber: R_47k_0402; Value: 47k

## Sheet SoM.SchDoc
size A3; SheetNumber: 1; SheetTotal: 1; PageSetup: Record=PageOptions|CenterHorizontal=True|CenterVertical=True|PrintScale=0.97|XCorrection=1.00|YCorrection=1.00|PrintKind=1|BorderSize=5000000|LeftOffset=0|BottomOffset=0|Orientation=2|PaperLength=2970|PaperWidth=2100|Scale=100|PaperSource=7|PrintQuality=600|MediaType=1|DitherType=10|PaperKind=A4|PrintScaleMode=1
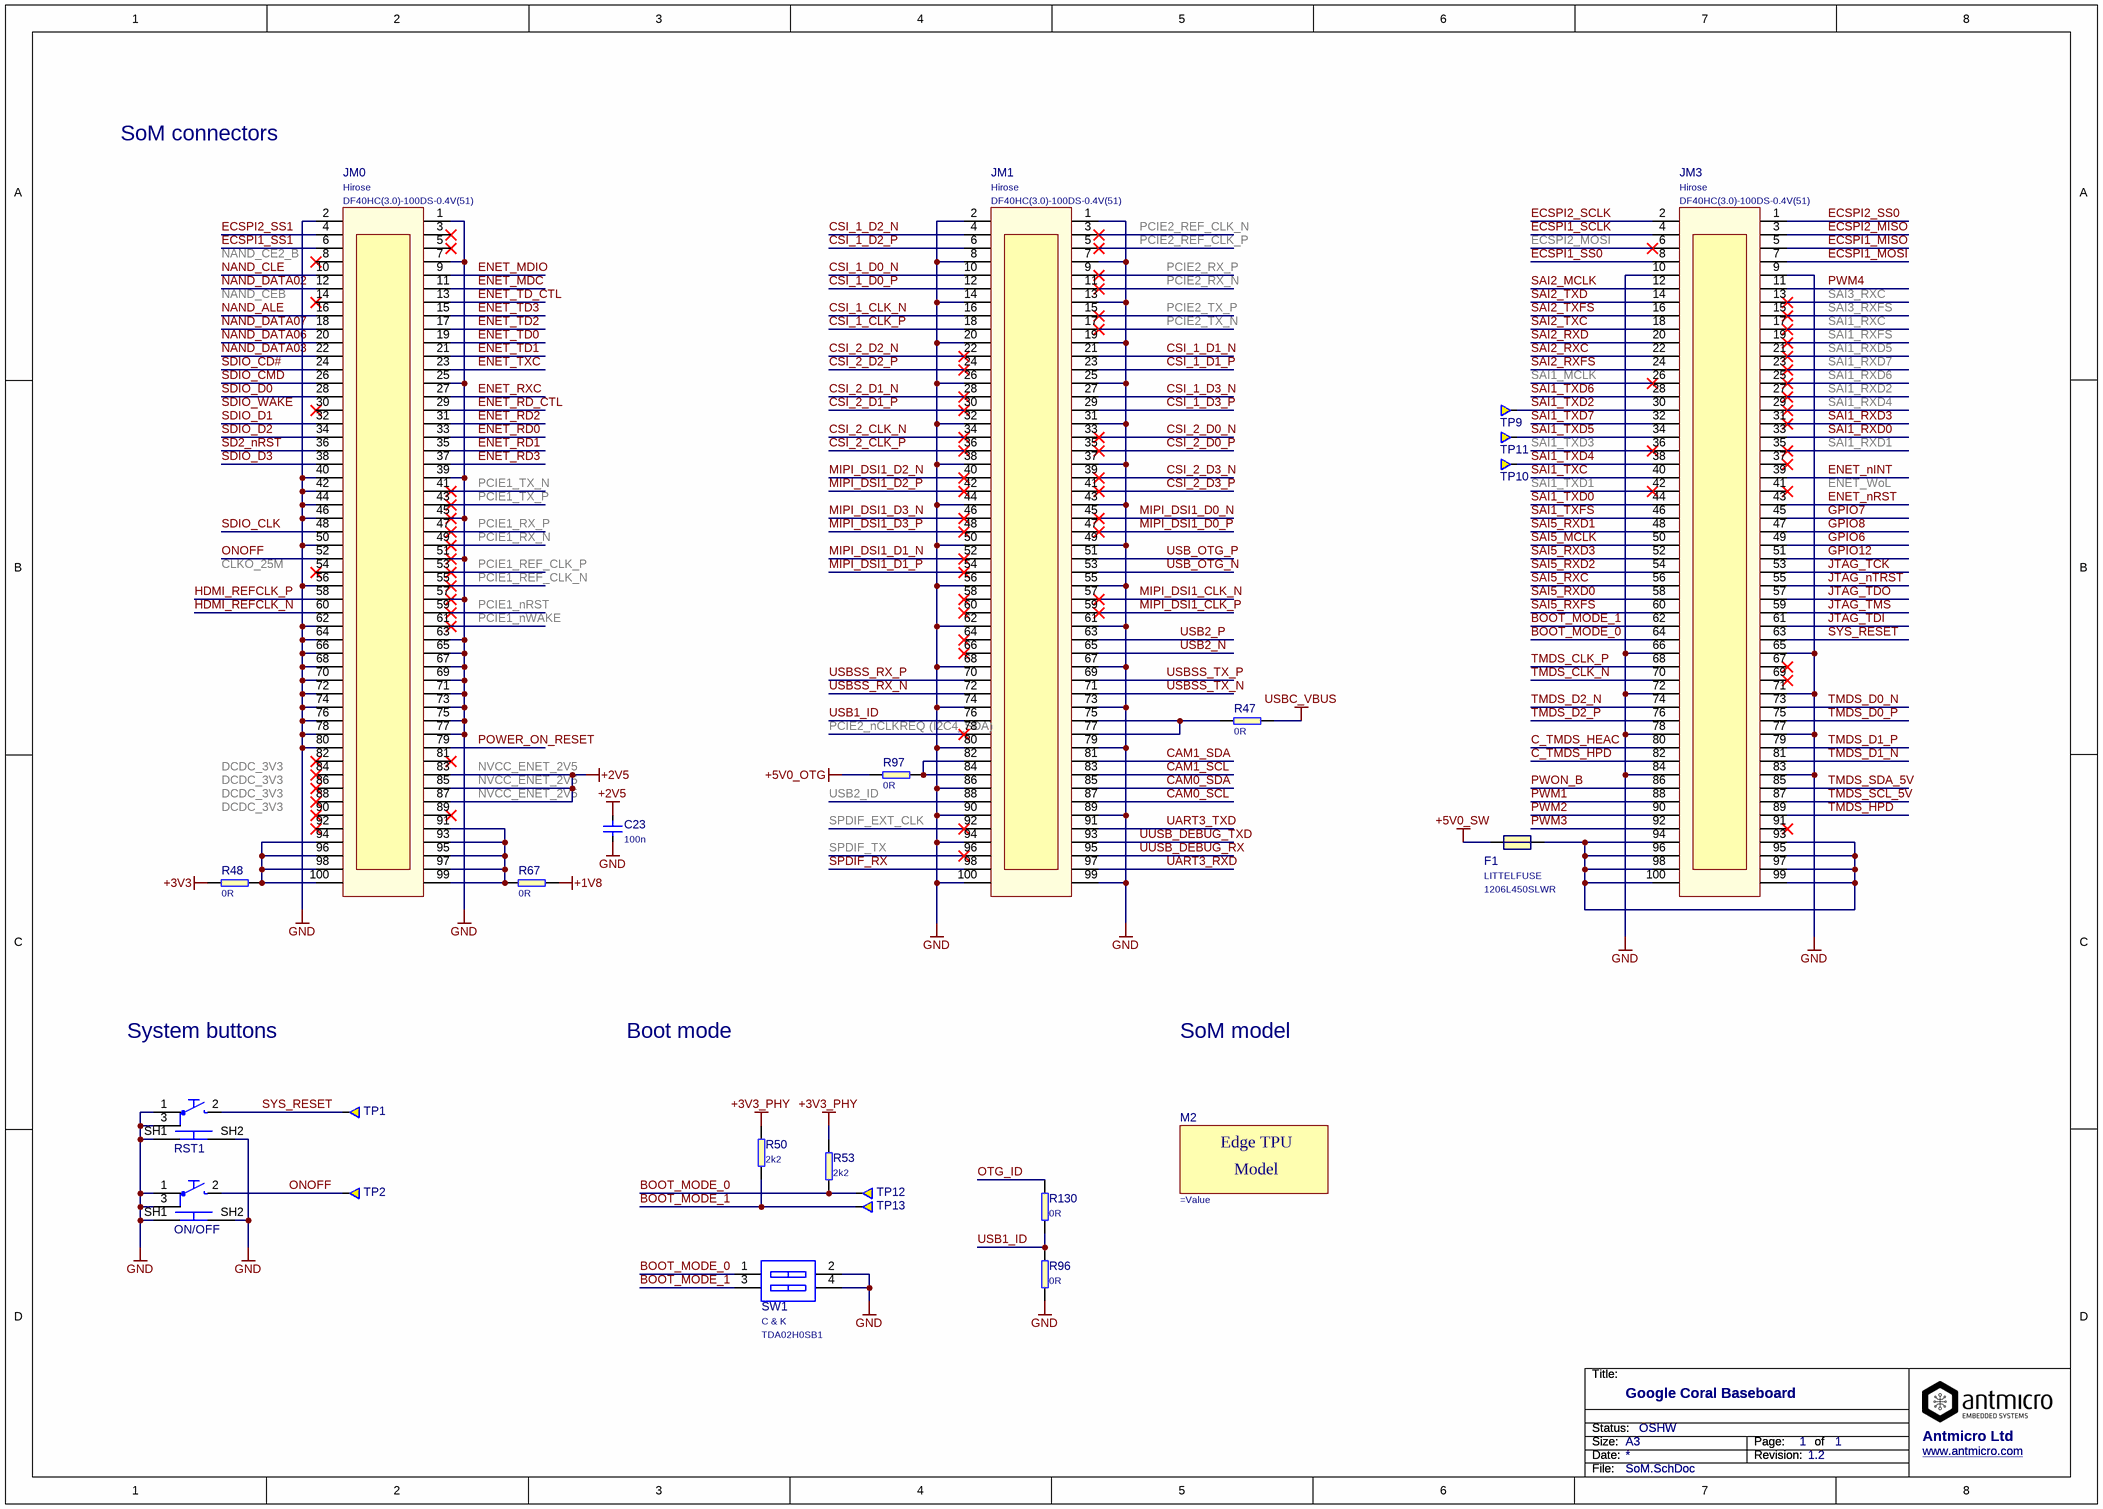
[diagram p4: SoM.SchDoc]

### Parts
C23  100n  [C_0402]
F1  PartNumber: 1206L450SLWR  Manufacturer: LITTELFUSE  [Fuse-1206]  (hidden comment: Value)
JM0  DF40HC(3.0)-100DS-0.4V(51)  Manufacturer: Hirose  [DF40HC(3.0)-100DS-0.4V(51)]
JM1  DF40HC(3.0)-100DS-0.4V(51)  Manufacturer: Hirose  [DF40HC(3.0)-100DS-0.4V(51)]
JM3  DF40HC(3.0)-100DS-0.4V(51)  Manufacturer: Hirose  [DF40HC(3.0)-100DS-0.4V(51)]
M2  (no value)  [Edge-TPU-SOM-model]
ON/OFF  TL3340AF160QG  [TL3340AF160QG]  (value not drawn)
R47  0R  [0402]
R48  0R  [0805]
R50  2k2  [0402]
R53  2k2  [0402]
R67  0R  [0805]
R96  0R  [0402]
R97  0R  [0402]
R130  0R  [0402]
RST1  TL3340AF160QG  [TL3340AF160QG]  (value not drawn)
SW1  TDA02H0SB1  Manufacturer: C & K  [TDA02H0SB1]
TP1  Testpad  [TP-R-1.5]  (value not drawn)  (no BOM)
TP2  Testpad  [TP-R-1.5]  (value not drawn)  (no BOM)
TP9  Testpad  [TP-R-1.5]  (value not drawn)  (no BOM)
TP10  Testpad  [TP-R-1.5]  (value not drawn)  (no BOM)
TP11  Testpad  [TP-R-1.5]  (value not drawn)  (no BOM)
TP12  Testpad  [TP-R-1.5]  (value not drawn)  (no BOM)
TP13  Testpad  [TP-R-1.5]  (value not drawn)  (no BOM)

### Nets
+1V8: R67.2
+3V3: R48.2
+3V3_PHY: R50.2 R53.2
+5V0_OTG: R97.2
+5V0_SW: F1.1
GND: C23.2 JM0.1(ETH_VDD) JM0.2 JM0.7(ETH_L1_C) JM0.25(PE8) JM0.39(GND) JM0.40(PC12) JM0.42(PB10) JM0.44(PB4) JM0.45(PA14) JM0.46(PG9) JM0.50(BOOT0) JM0.51(PI3) JM0.56(PB7) JM0.57(PI0) JM0.62(PB12) JM0.63(PG7) JM0.64(GND) JM0.65(PG6) JM0.66(BOOT1) JM0.67(PD3) JM0.68(PG11) JM0.69(PG10) JM0.70(PH15) JM0.71(PG12) JM0.72(PH12) JM0.73(PH13) JM0.74(PH8) JM0.75(PH9) JM0.76(PI5) JM0.77(GND) JM0.78(PI6) JM0.80(ETH_R_N) JM1.1(ETH_VDD) JM1.2 JM1.7(ETH_L1_C) JM1.8(GND) JM1.13(BATT_P) JM1.14(NRST) JM1.19(CHRG_NTC) JM1.20(PD14) JM1.25(PE8) JM1.26(PA8) JM1.31(PD5) JM1.32(PA10) JM1.37(PF0) JM1.38(PC11) JM1.43(PB3) JM1.44(PB4) JM1.49(PI2) JM1.50(BOOT0) JM1.55(PA11) JM1.56(PB7) JM1.61(PC7) JM1.62(PB12) JM1.67(PD3) JM1.68(PG11) JM1.73(PH13) JM1.74(PH8) JM1.79(PB8) JM1.80(ETH_R_N) JM1.86(PB8) JM1.89(PB8) JM1.90(PB8) JM1.94(PB8) JM1.99(PB8) JM1.100(PB8) JM3.9(GND) JM3.10(PB15) JM3.65(PG6) JM3.66(BOOT1) JM3.71(PG12) JM3.72(PH12) JM3.77(GND) JM3.78(PI6) JM3.83(PB8) JM3.84(PB8) ON/OFF.1 ON/OFF.3 ON/OFF.SH1 ON/OFF.SH2 R96.1 RST1.1 RST1.3 RST1.SH1 RST1.SH2 SW1.2 SW1.4
NVCC_ENET_2V5: C23.1 JM0.83(PB8) JM0.85(PB8) JM0.87(PB8)  [also labelled +2V5]
USBC_VBUS: R47.1
BOOT_MODE_0: JM3.64(GND) R53.1 SW1.1 TP12.1
BOOT_MODE_1: JM3.62(PB12) R50.1 SW1.3 TP13.1
C_TMDS_HEAC: JM3.80(ETH_R_N)
C_TMDS_HPD: JM3.82(PB8)
CAM0_SCL: JM1.87(PB8)
CAM0_SDA: JM1.85(PB8)
CAM1_SCL: JM1.83(PB8)
CAM1_SDA: JM1.81(PB8)
CSI_1_CLK_N: JM1.16(PE10)
CSI_1_CLK_P: JM1.18(PE9)
CSI_1_D0_N: JM1.10(PB15)
CSI_1_D0_P: JM1.12(PB14)
CSI_1_D1_N: JM1.21(1V8)
CSI_1_D1_P: JM1.23(PE7)
CSI_1_D2_N: JM1.4
CSI_1_D2_P: JM1.6
CSI_1_D3_N: JM1.27(PD1)
CSI_1_D3_P: JM1.29(PD0)
CSI_2_CLK_N: JM1.34(PC10)
CSI_2_CLK_P: JM1.36(PA15)
CSI_2_D0_N: JM1.33(PD4)
CSI_2_D0_P: JM1.35(PD7)
CSI_2_D1_N: JM1.28(GND)
CSI_2_D1_P: JM1.30(PA9)
CSI_2_D2_N: JM1.22(PD15)
CSI_2_D2_P: JM1.24(PC6)
CSI_2_D3_N: JM1.39(GND)
CSI_2_D3_P: JM1.41(RST_JTAG_O)
ECSPI1_MISO: JM3.5(ETH_T_P)
ECSPI1_MOSI: JM3.7(ETH_L1_C)
ECSPI1_SCLK: JM3.4
ECSPI1_SS0: JM3.8(GND)
ECSPI1_SS1: JM0.6
ECSPI2_MISO: JM3.3(ETH_T_N)
ECSPI2_MOSI: JM3.6
ECSPI2_SCLK: JM3.2
ECSPI2_SS0: JM3.1(ETH_VDD)
ECSPI2_SS1: JM0.4
ENET_MDC: JM0.11(BATT_P)
ENET_MDIO: JM0.9(GND)
ENET_nINT: JM3.39(GND)
ENET_nRST: JM3.43(PB3)
ENET_RD0: JM0.33(PD4)
ENET_RD1: JM0.35(PD7)
ENET_RD2: JM0.31(PD5)
ENET_RD3: JM0.37(PF0)
ENET_RD_CTL: JM0.29(PD0)
ENET_RXC: JM0.27(PD1)
ENET_TD0: JM0.19(CHRG_NTC)
ENET_TD1: JM0.21(1V8)
ENET_TD2: JM0.17(USB_VBUS)
ENET_TD3: JM0.15(USB_VBUS)
ENET_TD_CTL: JM0.13(BATT_P)
ENET_TXC: JM0.23(PE7)
GPIO6: JM3.49(PI2)
GPIO7: JM3.45(PA14)
GPIO8: JM3.47(PA13)
GPIO12: JM3.51(PI3)
HDMI_REFCLK_N: JM0.60(PI1)
HDMI_REFCLK_P: JM0.58(PB5)
JTAG_nTRST: JM3.55(PA11)
JTAG_TCK: JM3.53(PA12)
JTAG_TDI: JM3.61(PC7)
JTAG_TDO: JM3.57(PI0)
JTAG_TMS: JM3.59(PD6)
MIPI_DSI1_CLK_N: JM1.57(PI0)
MIPI_DSI1_CLK_P: JM1.59(PD6)
MIPI_DSI1_D0_N: JM1.45(PA14)
MIPI_DSI1_D0_P: JM1.47(PA13)
MIPI_DSI1_D1_N: JM1.52(PC8)
MIPI_DSI1_D1_P: JM1.54(PB6)
MIPI_DSI1_D2_N: JM1.40(PC12)
MIPI_DSI1_D2_P: JM1.42(PB10)
MIPI_DSI1_D3_N: JM1.46(PG9)
MIPI_DSI1_D3_P: JM1.48(GND)
NAND_ALE: JM0.16(PE10)
NAND_CLE: JM0.10(PB15)
NAND_DATA02: JM0.12(PB14)
NAND_DATA03: JM0.22(PD15)
NAND_DATA06: JM0.20(PD14)
NAND_DATA07: JM0.18(PE9)
ONOFF: JM0.52(PC8) ON/OFF.2 TP2.1
OTG_ID: R130.2
PCIE1_nRST: JM0.59(PD6)
PCIE1_nWAKE: JM0.61(PC7)
PCIE1_REF_CLK_N: JM0.55(PA11)
PCIE1_REF_CLK_P: JM0.53(PA12)
PCIE1_RX_N: JM0.49(PI2)
PCIE1_RX_P: JM0.47(PA13)
PCIE1_TX_N: JM0.41(RST_JTAG_O)
PCIE1_TX_P: JM0.43(PB3)
PCIE2_nCLKREQ (I2C4_SDA): JM1.78(PI6)
PCIE2_REF_CLK_N: JM1.3(ETH_T_N)
PCIE2_REF_CLK_P: JM1.5(ETH_T_P)
PCIE2_RX_N: JM1.11(BATT_P)
PCIE2_RX_P: JM1.9(GND)
PCIE2_TX_N: JM1.17(USB_VBUS)
PCIE2_TX_P: JM1.15(USB_VBUS)
POWER_ON_RESET: JM0.79(PB8)
PWM1: JM3.88(PB8)
PWM2: JM3.90(PB8)
PWM3: JM3.92(PB8)
PWM4: JM3.11(BATT_P)
PWON_B: JM3.86(PB8)
SAI1_MCLK: JM3.26(PA8)
SAI1_RXC: JM3.17(USB_VBUS)
SAI1_RXD0: JM3.33(PD4)
SAI1_RXD1: JM3.35(PD7)
SAI1_RXD2: JM3.27(PD1)
SAI1_RXD3: JM3.31(PD5)
SAI1_RXD4: JM3.29(PD0)
SAI1_RXD5: JM3.21(1V8)
SAI1_RXD6: JM3.25(PE8)
SAI1_RXD7: JM3.23(PE7)
SAI1_RXFS: JM3.19(CHRG_NTC)
SAI1_TXC: JM3.40(PC12)
SAI1_TXD0: JM3.44(PB4)
SAI1_TXD1: JM3.42(PB10)
SAI1_TXD2: JM3.30(PA9) TP9.1
SAI1_TXD3: JM3.36(PA15)
SAI1_TXD4: JM3.38(PC11) TP10.1
SAI1_TXD5: JM3.34(PC10) TP11.1
SAI1_TXD6: JM3.28(GND)
SAI1_TXD7: JM3.32(PA10)
SAI1_TXFS: JM3.46(PG9)
SAI2_MCLK: JM3.12(PB14)
SAI2_RXC: JM3.22(PD15)
SAI2_RXD: JM3.20(PD14)
SAI2_RXFS: JM3.24(PC6)
SAI2_TXC: JM3.18(PE9)
SAI2_TXD: JM3.14(NRST)
SAI2_TXFS: JM3.16(PE10)
SAI3_RXC: JM3.13(BATT_P)
SAI3_RXFS: JM3.15(USB_VBUS)
SAI5_MCLK: JM3.50(BOOT0)
SAI5_RXC: JM3.56(PB7)
SAI5_RXD0: JM3.58(PB5)
SAI5_RXD1: JM3.48(GND)
SAI5_RXD2: JM3.54(PB6)
SAI5_RXD3: JM3.52(PC8)
SAI5_RXFS: JM3.60(PI1)
SD2_nRST: JM0.36(PA15)
SDIO_CD#: JM0.24(PC6)
SDIO_CLK: JM0.48(GND)
SDIO_CMD: JM0.26(PA8)
SDIO_D0: JM0.28(GND)
SDIO_D1: JM0.32(PA10)
SDIO_D2: JM0.34(PC10)
SDIO_D3: JM0.38(PC11)
SPDIF_EXT_CLK: JM1.92(PB8)
SPDIF_RX: JM1.98(PB8)
SPDIF_TX: JM1.96(PB8)
SYS_RESET: JM3.63(PG7) RST1.2 TP1.1
TMDS_CLK_N: JM3.70(PH15)
TMDS_CLK_P: JM3.68(PG11)
TMDS_D0_N: JM3.73(PH13)
TMDS_D0_P: JM3.75(PH9)
TMDS_D1_N: JM3.81(PB8)
TMDS_D1_P: JM3.79(PB8)
TMDS_D2_N: JM3.74(PH8)
TMDS_D2_P: JM3.76(PI5)
TMDS_HPD: JM3.89(PB8)
TMDS_SCL_5V: JM3.87(PB8)
TMDS_SDA_5V: JM3.85(PB8)
UART3_RXD: JM1.97(PB8)
UART3_TXD: JM1.91(PB8)
USB1_ID: JM1.76(PI5) R96.2 R130.1
USB2_ID: JM1.88(PB8)
USB2_N: JM1.65(PG6)
USB2_P: JM1.63(PG7)
USB_OTG_N: JM1.53(PA12)
USB_OTG_P: JM1.51(PI3)
USBSS_RX_N: JM1.72(PH12)
USBSS_RX_P: JM1.70(PH15)
USBSS_TX_N: JM1.71(PG12)
USBSS_TX_P: JM1.69(PG10)
UUSB_DEBUG_RX: JM1.95(PB8)
UUSB_DEBUG_TXD: JM1.93(PB8)
NetF1_2: F1.2 JM3.93(PB8) JM3.94(PB8) JM3.95(PB8) JM3.96(PB8) JM3.97(PB8) JM3.98(PB8) JM3.99(PB8) JM3.100(PB8)
NetJM0_91: JM0.91(PB8) JM0.93(PB8) JM0.95(PB8) JM0.97(PB8) JM0.99(PB8) R67.1
NetJM0_94: JM0.94(PB8) JM0.96(PB8) JM0.98(PB8) JM0.100(PB8) R48.1
NetJM1_75: JM1.75(PH9) JM1.77(GND) R47.2
NetJM1_82: JM1.82(PB8) JM1.84(PB8) R97.1

Not connected (* = marked no-connect by the designer): JM0 3(ETH_T_N)* 5(ETH_T_P)* 8(GND)* 14(NRST)* 30(PA9)* 54(PB6)* 81(PB8)* 82(PB8)* 84(PB8)* 86(PB8)* 88(PB8)* 89(PB8)* 90(PB8)* 92(PB8)*; JM1 58(PB5)* 60(PI1)* 64(GND)* 66(BOOT1)*; JM3 37(PF0)* 41(RST_JTAG_O)* 67(PD3)* 69(PG10)* 91(PB8)*

### Notes on the sheet
- SoM connectors
- System buttons
- Boot mode
- SoM model
- Labels drawn without touching a wire or pin: CLKO_25M, DCDC_3V3, ENET_WoL, NAND_CE2_B, NAND_CEB, SDIO_WAKE
- Title:
- Size:
- Date:
- Status:
- A3
- Revision:
- Page:
- of
- Antmicro Ltd
- www.antmicro.com
- File:
- (in symbol Edge-TPU-SOM-model) Edge TPU; Model

### Library data of the parts
C23 = C_100n_0402: MLCC SMT Capacitor 100nF 0402; PartNumber: C_100n_0402; Value: 100n
F1 = LITTELFUSE_1206L450SLWR: PTC RESET 6V LO RHO 1206 4.50A; Value: 1206L450SLWR
JM0 JM1 JM3 = DF40HC(3.0)-100DS-0.4V(51): CONN RCPT 100POS 0.4MM SMD GOLD; PartNumber: DF40HC(3.0)-100DS-0.4V(51); Value: DF40HC(3.0)-100DS-0.4V(51)
M2 = Edge-TPU-SOM-model: Edge TPU SOM; PartNumber: Edge-TPU-SOM-model
ON/OFF RST1 = TL3340AF160QG: E-SWITCH  TL3340AF160QG  SWITCH, TACTILE SPST 50mA, SMD GULL WING; PartNumber: TL3340AF160QG; Value: TL3340AF160QG; Manufacturer: E-SWITCH
R47 R96 R97 R130 = R_0R_0402: SMT Resistor 0402; PartNumber: R_0R_0402; Value: 0R
R48 R67 = R_0R_0805: SMT Resistor 0R 0805; PartNumber: R_0R_0805; Value: 0R
R50 R53 = R_2k2_0402: RES, 2k2, 0402, 5%; PartNumber: R_2k2_0402; Value: 2k2
SW1 = TDA02H0SB1: TDA02H0SB1 - DIP / SIP Switch, 2 Circuits, SPST, SMD, TDA Series, DIP, 24 V; Value: TDA02H0SB1
TP1 TP2 TP9-TP13 = TP-R-1.5: Testpad, round, 1.5mm; PartNumber: Testpad

## Sheet Supply.SchDoc
size A3; SheetNumber: 1; SheetTotal: 1; PageSetup: Record=PageOptions|CenterHorizontal=True|CenterVertical=True|PrintScale=0.97|XCorrection=1.00|YCorrection=1.00|PrintKind=1|BorderSize=5000000|LeftOffset=0|BottomOffset=0|Orientation=2|PaperLength=2970|PaperWidth=2100|Scale=100|PaperSource=7|PrintQuality=600|MediaType=1|DitherType=10|PaperKind=A4|PrintScaleMode=1
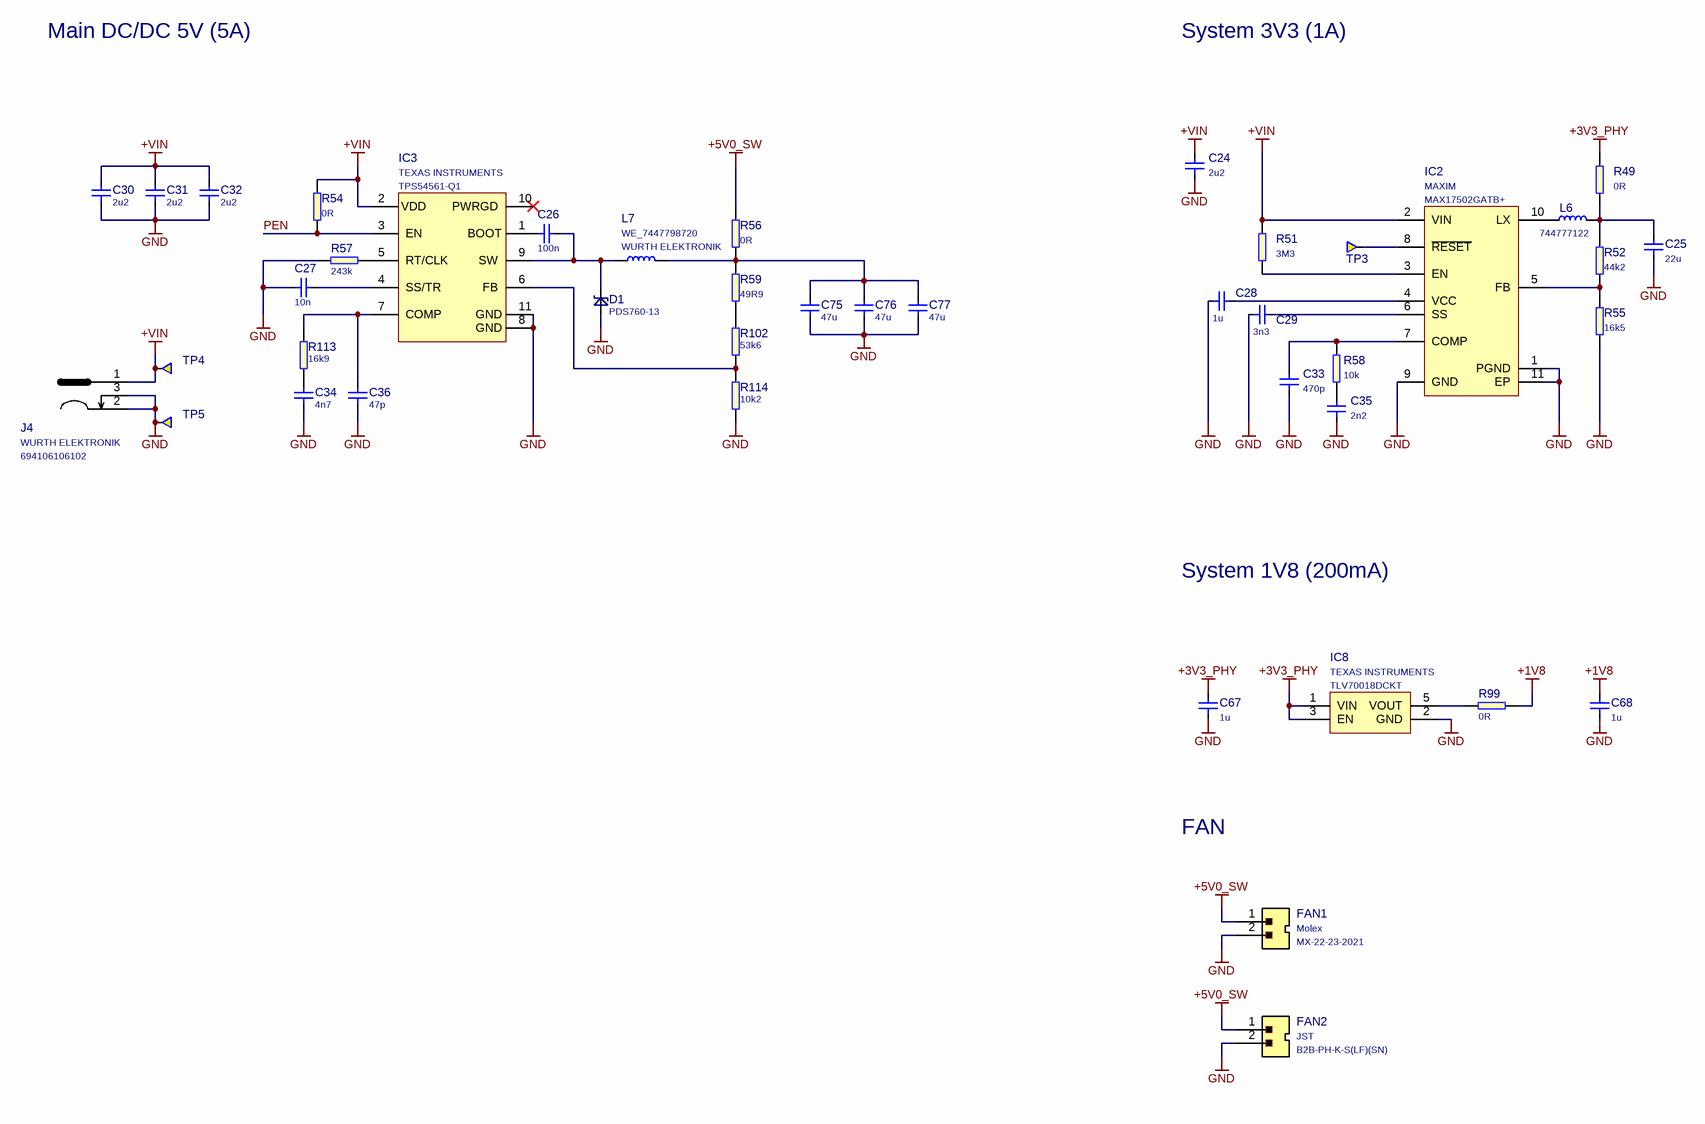
[diagram p5: Supply.SchDoc]

### Parts
C24  2u2  [1210]
C25  22u  [1210]
C26  100n  [0603]
C27  10n  [0402]
C28  1u  [C_0402]
C29  3n3  [0603]
C30  2u2  [1206]
C31  2u2  [1206]
C32  2u2  [1206]
C33  470p  [0603]
C34  4n7  [0402]
C35  2n2  [0603]
C36  47p  [0402]
C67  1u  [C_0402]
C68  1u  [C_0402]
C75  47u  [0805]
C76  47u  [0805]
C77  47u  [0805]
D1  PDS760-13  [PowerDI]
FAN1  Manufacturer: Molex  [molex_2223-2021]  (hidden comment: MX-22-23-2021)
FAN2  B2B-PH-K-S(LF)(SN)  Manufacturer: JST  [B2B-PH-K-S(LF)(SN)]
IC2  MAX17502GATB+  Manufacturer: MAXIM  [10-TDFN]
IC3  TPS54561-Q1  Manufacturer: TEXAS INSTRUMENTS  [WSON-10_4x4]
IC8  TLV70018DCKT  Manufacturer: TEXAS INSTRUMENTS  [SC70-5]
J4  Manufacturer: WURTH ELEKTRONIK  [694106106102]  (hidden comment: 694106106102)
L6  744777122  [WE_744777122]
L7  Manufacturer: WURTH ELEKTRONIK  [WE_7447798720]  (hidden comment: WE_7447798720)
R49  0R  [0805]
R51  3M3  [0402]
R52  44k2  [0402]
R54  0R  [0402]
R55  16k5  [0402]
R56  0R  [1206]
R57  243k  [0402]
R58  10k  [0402]
R59  49R9  [0402]
R99  0R  [0603]
R102  53k6  [0402]
R113  16k9  [0402]
R114  10k2  [0402]
TP3  (no value)  [TP-R-2.5]  (no BOM)
TP4  Testpad  [TP-R-1.5]  (value not drawn)  (no BOM)
TP5  Testpad  [TP-R-1.5]  (value not drawn)  (no BOM)

### Nets
+1V8: C68.2 R99.2
+3V3_PHY: C67.2 IC8.1(VIN) IC8.3(EN) R49.2
+5V0_SW: FAN1.1 FAN2.1 R56.2
+VIN: C24.2 C30.2 C31.2 C32.2 IC2.2(VIN) IC3.2(VDD) J4.1 R51.2 R54.2 TP4.1
GND: C24.1 C25.1 C27.1 C28.1 C29.1 C30.1 C31.1 C32.1 C33.1 C34.1 C35.1 C36.1 C67.1 C68.1 C75.1 C76.1 C77.1 D1.A FAN1.2 FAN2.2 IC2.1(PGND) IC2.9(GND) IC2.11(EP) IC3.8(GND) IC3.11(GND) IC8.2(GND) J4.2 J4.3 R55.1 R57.2 R114.1 TP5.1
PEN: IC3.3(EN) R54.1
NetC25_2: C25.2 L6.2 R49.1 R52.2
NetC26_1: C26.1 IC3.1(BOOT)
NetC26_2: C26.2 D1.C IC3.9(SW) L7.1
NetC27_2: C27.2 IC3.4(SS/TR)
NetC28_2: C28.2 IC2.4(VCC)
NetC29_2: C29.2 IC2.6(SS)
NetC33_2: C33.2 IC2.7(COMP) R58.2
NetC34_2: C34.2 R113.1
NetC35_2: C35.2 R58.1
NetC36_2: C36.2 IC3.7(COMP) R113.2
NetC75_2: C75.2 C76.2 C77.2 L7.2 R56.1 R59.2
NetIC2_3: IC2.3(EN) R51.1
NetIC2_5: IC2.5(FB) R52.1 R55.2
NetIC2_8: IC2.8(~{RESET}) TP3.1
NetIC2_10: IC2.10(LX) L6.1
NetIC3_5: IC3.5(RT/CLK) R57.1
NetIC3_6: IC3.6(FB) R102.1 R114.2
NetIC8_5: IC8.5(VOUT) R99.1
NetR59_1: R59.1 R102.2

Not connected (* = marked no-connect by the designer): IC3 10(PWRGD)*

### Notes on the sheet
- Main DC/DC 5V (5A)
- System 3V3 (1A)
- System 1V8 (200mA)
- FAN
- Title:
- Size:
- Date:
- Status:
- A3
- Revision:
- Page:
- of
- Antmicro Ltd
- www.antmicro.com
- File:

### Library data of the parts
C24 = C_2u2_1210: MLCC SMT Capacitor 2u2F 1210; Value: 2u2; PartNumber: C_2u2_1210
C25 = C_22u_1210: MLCC SMT Capacitor 22uF 1210; Value: 22u; PartNumber: C_22u_1210
C26 = C_100n_0603: MLCC SMT Capacitor 100nF 0603; Manufacturer: AVX; PartNumber: C_100n_0603; Value: 100n
C27 = C_10n_0402: MLCC SMT Capacitor 10nF 0402; Manufacturer: AVX; PartNumber: C_10n_0402; Value: 10n
C28 C67 C68 = C_1u_0402: MLCC SMT Capacitor 1uF 0402; Value: 1u; PartNumber: C_1u_0402
C29 = C_3n3_0603: MLCC SMT Capacitor 3n3F 0603; Value: 3n3; PartNumber: C_3n3_0603
C30-C32 = C_2u2_1206: MLCC SMT Capacitor 2u2F 1206; Manufacturer: Kemet; PartNumber: C_2u2_1206; Value: 2u2
C33 = C_470p_0603: MLCC SMT Capacitor 470pF 0603; Value: 470p; PartNumber: C_470p_0603
C34 = C_4n7_0402: MLCC SMT Capacitor 4n7F 0402; Manufacturer: TDK; PartNumber: C_4n7_0402; Value: 4n7
C35 = C_2n2_0603: MLCC SMT Capacitor 2n2F 0603; Value: 2n2; PartNumber: C_2n2_0603
C36 = C_47p_0402: MLCC SMT Capacitor 47pF 0402; Manufacturer: KEMET; PartNumber: C_47p_0402; Value: 47p
C75-C77 = C_47u_0805: MLCC SMT Capacitor 47uF 0805; Manufacturer: KEMET; PartNumber: C_47u_0805; Value: 47u
D1 = PDS760-13: Schottky Diodes & Rectifiers SCHOTTKY RECTIFIER; Manufacturer: DIODES INC.; PartNumber: PDS760-13; Value: PDS760-13
FAN1 = molex_2223-2021: Pinhead connector with key; PartNumber: 022232021 A-6373-02A222; Value: MX-22-23-2021
IC2 = MAX17502GATB+: DC-DC Switching (Step Down) Regulator, Adjustable, 600 kHz, 4.5V-60Vin, 0.9V-55.2V/1 A out, TDFN-10; Value: MAX17502GATB+; PartNumber: MAX17502GATB+
IC3 = TPS54561-Q1: IC REG BCK SPLIT RAIL ADJ 10WSON; PartNumber: TPS54561-Q1; Value: TPS54561-Q1
IC8 = TLV70018DCKT: Voltage Regulator, 2V to 5.5V, 175mV Dropout, 1.8Vout, 200mAout; PartNumber: TLV70018DCKT; Value: TLV70018DCKT
J4 = WE-694106106102: DC Power Jack Right Angled SMT Ø6.4 with 4 soldering pads & pegs WR-DC; Value: 694106106102; PartNumber: 694106106102
L6 = 744777122: Surface Mount Power Inductor, WE-PD Series, 22 µH, 1.41 A, 1.7 A, Shielded, 0.11 ohm; Manufacturer: WURTH ELEKTRONIK; Value: 744777122; PartNumber: 744777122
L7 = WE_7447798720: Fixed Inductors WE-PDF 1064 7.2uH 7.9A 12.8mOhm; PartNumber: WE_7447798720; Value: WE_7447798720
R49 = R_0R_0805: SMT Resistor 0R 0805; PartNumber: R_0R_0805; Value: 0R
R51 = R_3M3_0402: SMT Resistor 3M3 0402; Value: 3M3; PartNumber: R_3M3_0402
R52 = R_44k2_0402: SMT Resistor 0402; Value: 44k2; PartNumber: R_44k2_0402
R54 = R_0R_0402: SMT Resistor 0402; PartNumber: R_0R_0402; Value: 0R
R55 = R_16k5_0402_0.1%: RES, 16k5, 0402, 0.1%; Value: 16k5; PartNumber: R_16k5_0402_0.1%
R56 = R_0R_1206: RES, 0R, 1206; PartNumber: R_0R_1206; Value: 0R
R57 = R_243k_0402: RES, 243k, 0402; PartNumber: R_243k_0402; Value: 243k
R58 = R_10k_0402: SMT Resistor 0402; Value: 10k; PartNumber: R_10k_0402
R59 = R_49R9_0402: RES, 49R9, 0402; PartNumber: R_49R9_0402; Value: 49R9
R99 = R_0R_0603: SMT Resistor 0R 0603; PartNumber: R_0R_0603; Value: 0R
R102 = R_53k6_0402: SMT Resistor 0402; Manufacturer: TE CONNECTIVITY; PartNumber: R_53k6_0402; Value: 53k6
R113 = R_16k9_0402: SMT Resistor 0402; Manufacturer: PANASONIC; PartNumber: R_16k9_0402; Value: 16k9
R114 = R_10k2_0402_0.1%: RES, 10k2, 0402, 0.1%; Manufacturer: TE CONECTIVITY; PartNumber: R_10k2_0402_0.1%; Value: 10k2
TP3 = TP-R-2.5: Testpad, round, 2mm; PartNumber: Testpad
TP4 TP5 = TP-R-1.5: Testpad, round, 1.5mm; PartNumber: Testpad
FAN2 = B2B-PH-K-S(LF)(SN): PartNumber: B2B-PH-K-S(LF)(SN); Value: B2B-PH-K-S(LF)(SN)

## Sheet USB-Debug.SchDoc
size A3; SheetNumber: 1; SheetTotal: 1; PageSetup: Record=PageOptions|CenterHorizontal=True|CenterVertical=True|PrintScale=0.97|XCorrection=1.00|YCorrection=1.00|PrintKind=1|BorderSize=5000000|LeftOffset=0|BottomOffset=0|Orientation=2|PaperLength=2970|PaperWidth=2100|Scale=100|PaperSource=7|PrintQuality=600|MediaType=1|DitherType=10|PaperKind=A4|PrintScaleMode=1
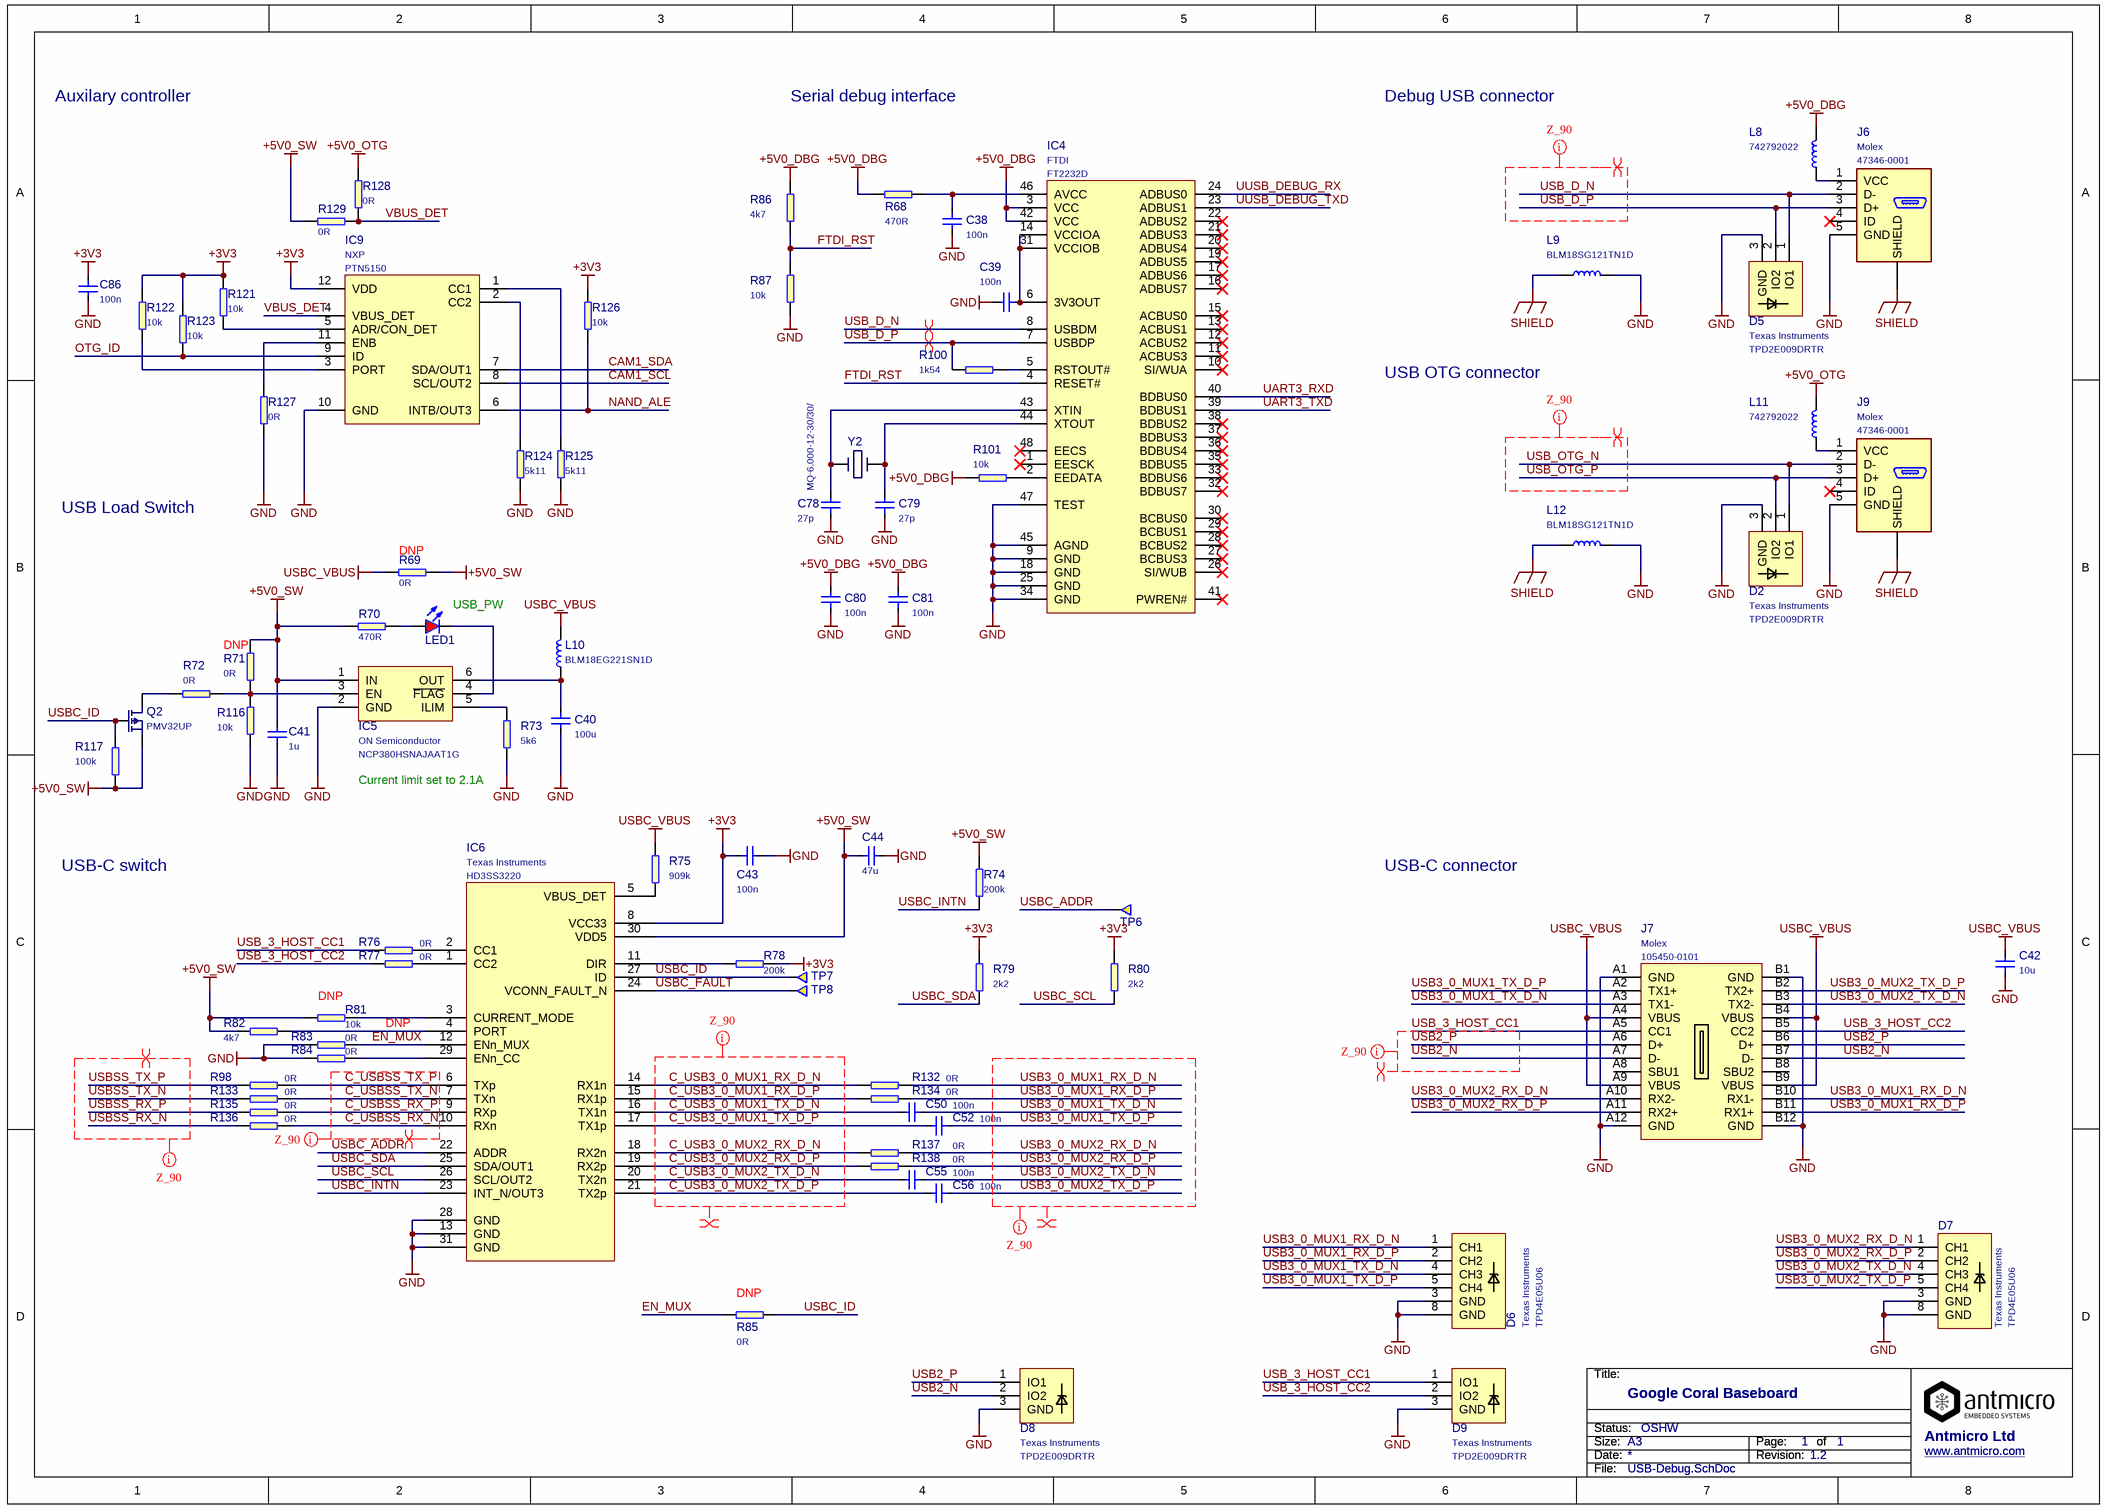
[diagram p6: USB-Debug.SchDoc]

### Parts
C38  100n  [C_0402]
C39  100n  [C_0402]
C40  100u  [1210]
C41  1u  [0603]
C42  10u  [0603]
C43  100n  [0603]
C44  47u  [0805]
C50  100n  [C_0402]
C52  100n  [C_0402]
C55  100n  [C_0402]
C56  100n  [C_0402]
C78  27p  [C_0402]
C79  27p  [C_0402]
C80  100n  [C_0402]
C81  100n  [C_0402]
C86  100n  [C_0402]
D2  TPD2E009DRTR  Manufacturer: Texas Instruments  [SOT-3]
D5  TPD2E009DRTR  Manufacturer: Texas Instruments  [SOT-3]
D6  Manufacturer: Texas Instruments  [TPD4E05U06_PASS]  (hidden comment: TPD4E05U06)
D7  Manufacturer: Texas Instruments  [TPD4E05U06_PASS]  (hidden comment: TPD4E05U06)
D8  TPD2E009DRTR  Manufacturer: Texas Instruments  [SOT-3]
D9  TPD2E009DRTR  Manufacturer: Texas Instruments  [SOT-3]
IC4  FT2232D  Manufacturer: FTDI  [LQFP-48]
IC5  NCP380HSNAJAAT1G  Manufacturer: ON Semiconductor  [TSOP-6]
IC6  HD3SS3220  Manufacturer: Texas Instruments  [RNH0030A]
IC9  PTN5150  Manufacturer: NXP  [PTN5150]
J6  Manufacturer: Molex  [CON-Molex-047346-0001]  (hidden comment: 47346-0001)
J7  105450-0101  Manufacturer: Molex  [CON-Molex-105450-0101]
J9  Manufacturer: Molex  [CON-Molex-047346-0001]  (hidden comment: 47346-0001)
L8  742792022  [0805]
L9  BLM18SG121TN1D  [0603]
L10  BLM18EG221SN1D  [0603]
L11  742792022  [0805]
L12  BLM18SG121TN1D  [0603]
LED1  KPT-1608EC  [LED0603]  (value not drawn)
Q2  PMV32UP  [SOT-23]
R68  470R  [0402]
R69  0R  [0603]
R70  470R  [0603]
R71  0R  [0402]
R72  0R  [0402]
R73  5k6  [0603]
R74  200k  [0402]
R75  909k  [0402]
R76  0R  [0402]
R77  0R  [0402]
R78  200k  [0402]
R79  2k2  [0402]
R80  2k2  [0402]
R81  10k  [0402]
R82  4k7  [0402]
R83  0R  [0402]
R84  0R  [0402]
R85  0R  [0402]
R86  4k7  [0402]
R87  10k  [0402]
R98  0R  [0402]
R100  1k54  [0402]
R101  10k  [0402]
R116  10k  [0402]
R117  100k  [0402]
R121  10k  [0402]
R122  10k  [0402]
R123  10k  [0402]
R124  5k11  [0402]
R125  5k11  [0402]
R126  10k  [0402]
R127  0R  [0402]
R128  0R  [0402]
R129  0R  [0402]
R132  0R  [0402]
R133  0R  [0402]
R134  0R  [0402]
R135  0R  [0402]
R136  0R  [0402]
R137  0R  [0402]
R138  0R  [0402]
TP6  Testpad  [TP-R-1.5]  (value not drawn)  (no BOM)
TP7  Testpad  [TP-R-1.5]  (value not drawn)  (no BOM)
TP8  Testpad  [TP-R-1.5]  (value not drawn)  (no BOM)
Y2  MQ-6.000-12-30/30/  [Crystal_5x7mm]

### Nets
+3V3: C43.1 C86.1 IC6.8(VCC33) IC9.12(VDD) R78.2 R79.2 R80.2 R121.2 R122.2 R123.2 R126.2
+5V0_DBG: C80.2 C81.2 IC4.3(VCC) IC4.42(VCC) L8.2 R68.1 R86.2 R101.1
+5V0_OTG: L11.2 R128.2
+5V0_SW: C41.2 C44.1 IC5.1(IN) IC6.30(VDD5) Q2.2(S) R69.2 R70.2 R71.2 R74.2 R81.1 R82.1 R117.1 R129.2
GND: C38.2 C39.2 C40.2 C41.1 C42.1 C43.2 C44.2 C78.1 C79.1 C80.1 C81.1 C86.2 D2.3(GND) D5.3(GND) D6.3(GND) D6.8(GND) D7.3(GND) D7.8(GND) D8.3(GND) D9.3(GND) IC4.9(GND) IC4.18(GND) IC4.25(GND) IC4.34(GND) IC4.45(AGND) IC4.47(TEST) IC5.2(GND) IC6.13(GND) IC6.28(GND) IC6.31(GND) IC9.10(GND) J6.5(GND) J7.A1(GND) J7.A12(GND) J7.B1(GND) J7.B12(GND) J9.5(GND) L9.2 L12.2 R73.1 R83.1 R84.1 R87.1 R116.1 R124.1 R125.1 R127.1
SHIELD: J6.S(SHIELD) J9.S(SHIELD) L9.1 L12.1
USBC_VBUS: C42.2 J7.A4(VBUS) J7.A9(VBUS) J7.B4(VBUS) J7.B9(VBUS) L10.2 R69.1 R75.2
C_USB3_0_MUX1_RX_D_N: IC6.14(RX1n) R132.1
C_USB3_0_MUX1_RX_D_P: IC6.15(RX1p) R134.1
C_USB3_0_MUX1_TX_D_N: C50.2 IC6.16(TX1n)
C_USB3_0_MUX1_TX_D_P: C52.2 IC6.17(TX1p)
C_USB3_0_MUX2_RX_D_N: IC6.18(RX2n) R137.1
C_USB3_0_MUX2_RX_D_P: IC6.19(RX2p) R138.1
C_USB3_0_MUX2_TX_D_N: C55.2 IC6.20(TX2n)
C_USB3_0_MUX2_TX_D_P: C56.2 IC6.21(TX2p)
C_USBSS_RX_N: IC6.10(RXn) R136.2
C_USBSS_RX_P: IC6.9(RXp) R135.2
C_USBSS_TX_N: IC6.7(TXn) R133.2
C_USBSS_TX_P: IC6.6(TXp) R98.2
CAM1_SCL: IC9.8(SCL/OUT2)
CAM1_SDA: IC9.7(SDA/OUT1)
EN_MUX: IC6.12(ENn_MUX) R83.2 R85.1
FTDI_RST: IC4.4(RESET#) R86.1 R87.2
NAND_ALE: IC9.6(INTB/OUT3) R126.1
OTG_ID: IC9.9(ID) R123.1
UART3_RXD: IC4.40(BDBUS0)
UART3_TXD: IC4.39(BDBUS1)
USB2_N: D8.2(IO2) J7.A7(D-) J7.B7(D-)
USB2_P: D8.1(IO1) J7.A6(D+) J7.B6(D+)
USB3_0_MUX1_RX_D_N: D6.1(CH1) J7.B10(RX1-) R132.2
USB3_0_MUX1_RX_D_P: D6.2(CH2) J7.B11(RX1+) R134.2
USB3_0_MUX1_TX_D_N: C50.1 D6.4(CH3) J7.A3(TX1-)
USB3_0_MUX1_TX_D_P: C52.1 D6.5(CH4) J7.A2(TX1+)
USB3_0_MUX2_RX_D_N: D7.1(CH1) J7.A10(RX2-) R137.2
USB3_0_MUX2_RX_D_P: D7.2(CH2) J7.A11(RX2+) R138.2
USB3_0_MUX2_TX_D_N: C55.1 D7.4(CH3) J7.B3(TX2-)
USB3_0_MUX2_TX_D_P: C56.1 D7.5(CH4) J7.B2(TX2+)
USB_3_HOST_CC1: D9.1(IO1) J7.A5(CC1) R76.1
USB_3_HOST_CC2: D9.2(IO2) J7.B5(CC2) R77.1
USB_D_N: D5.1(IO1) IC4.8(USBDM) J6.2(D-)
USB_D_P: D5.2(IO2) IC4.7(USBDP) J6.3(D+) R100.1
USB_OTG_N: D2.1(IO1) J9.2(D-)
USB_OTG_P: D2.2(IO2) J9.3(D+)
USBC_ADDR: IC6.22(ADDR) TP6.1
USBC_FAULT: IC6.24(VCONN_FAULT_N) TP8.1
USBC_ID: IC6.27(ID) Q2.1(G) R85.2 R117.2 TP7.1
USBC_INTN: IC6.23(INT_N/OUT3) R74.1
USBC_SCL: IC6.26(SCL/OUT2) R80.1
USBC_SDA: IC6.25(SDA/OUT1) R79.1
USBSS_RX_N: R136.1
USBSS_RX_P: R135.1
USBSS_TX_N: R133.1
USBSS_TX_P: R98.1
UUSB_DEBUG_RX: IC4.24(ADBUS0)
UUSB_DEBUG_TXD: IC4.23(ADBUS1)
VBUS_DET: IC9.4(VBUS_DET) R128.1 R129.1
NetC38_1: C38.1 IC4.46(AVCC) R68.2
NetC39_1: C39.1 IC4.6(3V3OUT) IC4.14(VCCIOA) IC4.31(VCCIOB)
NetC40_1: C40.1 IC5.6(OUT) L10.1
NetC78_2: C78.2 IC4.43(XTIN) Y2.1
NetC79_2: C79.2 IC4.44(XTOUT) Y2.3
NetIC4_2: IC4.2(EEDATA) R101.2
NetIC4_5: IC4.5(RSTOUT#) R100.2
NetIC5_3: IC5.3(EN) R71.1 R72.2 R116.2
NetIC5_4: IC5.4(~{FLAG}) LED1.K
NetIC5_5: IC5.5(ILIM) R73.2
NetIC6_1: IC6.1(CC2) R77.2
NetIC6_2: IC6.2(CC1) R76.2
NetIC6_3: IC6.3(CURRENT_MODE) R81.2
NetIC6_4: IC6.4(PORT) R82.2
NetIC6_5: IC6.5(VBUS_DET) R75.1
NetIC6_11: IC6.11(DIR) R78.1
NetIC6_29: IC6.29(ENn_CC) R84.2
NetIC9_1: IC9.1(CC1) R125.2
NetIC9_2: IC9.2(CC2) R124.2
NetIC9_3: IC9.3(PORT) R122.1
NetIC9_5: IC9.5(ADR/CON_DET) R121.1
NetIC9_11: IC9.11(ENB) R127.2
NetJ6_1: J6.1(VCC) L8.1
NetJ9_1: J9.1(VCC) L11.1
NetLED1_A: LED1.A R70.1
NetQ2_3: Q2.3(D) R72.1

Not connected (* = marked no-connect by the designer): IC4 1(EESCK)* 10(SI/WUA)* 11(ACBUS3)* 12(ACBUS2)* 13(ACBUS1)* 15(ACBUS0)* 16(ADBUS7)* 17(ADBUS6)* 19(ADBUS5)* 20(ADBUS4)* 21(ADBUS3)* 22(ADBUS2)* 26(SI/WUB)* 27(BCBUS3)* 28(BCBUS2)* 29(BCBUS1)* 30(BCBUS0)* 32(BDBUS7)* 33(BDBUS6)* 35(BDBUS5)* 36(BDBUS4)* 37(BDBUS3)* 38(BDBUS2)* 41(PWREN#)* 48(EECS)*; J6 4(ID)*; J7 A8(SBU1) B8(SBU2); J9 4(ID)*

### Layout directives
differential pair: C_USB3_0_MUX1_RX_D_N, C_USB3_0_MUX1_RX_D_P, C_USB3_0_MUX1_TX_D_N, C_USB3_0_MUX1_TX_D_P, C_USB3_0_MUX2_RX_D_N, C_USB3_0_MUX2_RX_D_P, C_USB3_0_MUX2_TX_D_N, C_USB3_0_MUX2_TX_D_P, C_USBSS_RX_N, C_USBSS_RX_P, C_USBSS_TX_N, C_USBSS_TX_P, USB2_N, USB2_P, USB3_0_MUX1_RX_D_N, USB3_0_MUX1_RX_D_P, USB3_0_MUX1_TX_D_N, USB3_0_MUX1_TX_D_P, USB3_0_MUX2_RX_D_N, USB3_0_MUX2_RX_D_P, USB3_0_MUX2_TX_D_N, USB3_0_MUX2_TX_D_P, USB_3_HOST_CC1, USB_D_N, USB_D_P, USB_OTG_N, USB_OTG_P, USBSS_RX_N, USBSS_RX_P, USBSS_TX_N, USBSS_TX_P
net class Z_90: C_USB3_0_MUX1_RX_D_N, C_USB3_0_MUX1_RX_D_P, C_USB3_0_MUX1_TX_D_N, C_USB3_0_MUX1_TX_D_P, C_USB3_0_MUX2_RX_D_N, C_USB3_0_MUX2_RX_D_P, C_USB3_0_MUX2_TX_D_N, C_USB3_0_MUX2_TX_D_P, C_USBSS_RX_N, C_USBSS_RX_P, C_USBSS_TX_N, C_USBSS_TX_P, USB2_N, USB2_P, USB3_0_MUX1_RX_D_N, USB3_0_MUX1_RX_D_P, USB3_0_MUX1_TX_D_N, USB3_0_MUX1_TX_D_P, USB3_0_MUX2_RX_D_N, USB3_0_MUX2_RX_D_P, USB3_0_MUX2_TX_D_N, USB3_0_MUX2_TX_D_P, USB_3_HOST_CC1, USB_D_N, USB_D_P, USB_OTG_N, USB_OTG_P, USBSS_RX_N, USBSS_RX_P, USBSS_TX_N, USBSS_TX_P

### Notes on the sheet
- Auxilary controller
- Serial debug interface
- Debug USB connector
- USB OTG connector
- USB Load Switch
- (near R69) DNP
- (near R71) DNP
- (near LED1) USB_PW
- (near R73) Current limit set to 2.1A
- USB-C switch
- USB-C connector
- (near R81) DNP
- DNP
- (near R85) DNP
- Title:
- Size:
- Date:
- Status:
- A3
- Revision:
- Page:
- of
- Antmicro Ltd
- www.antmicro.com
- File:

### Library data of the parts
C38 C39 C50 C52 C55 C56 C80 C81 C86 = C_100n_0402: MLCC SMT Capacitor 100nF 0402; PartNumber: C_100n_0402; Value: 100n
C40 = C_100u_1210_X5R: MLCC SMT Capacitor 100uF 1210 X5R; Value: 100u; PartNumber: C_100u_1210_X5R
C41 = C_1u_0603: MLCC SMT Capacitor 1uF 0603; Value: 1u; PartNumber: C_1u_0603
C42 = C_10u_0603: MLCC SMT Capacitor 10uF 0603; PartNumber: C_10u_0603; Value: 10u
C43 = C_100n_0603: as C26 on sheet Supply; PartNumber: C_100n_0603; Value: 100n
C44 = C_47u_0805: as C75 on sheet Supply; PartNumber: C_47u_0805; Value: 47u
C78 C79 = C_27p_0402: MLCC SMT Capacitor 27pF 0402; PartNumber: C_27p_0402; Value: 27p
D2 D5 D8 D9 = TPD2E009DRTR: ESD Suppressors 2-CH; Value: TPD2E009DRTR; PartNumber: TPD2E009DRTR
D6 D7 = TPD4E05U06_PASS: ESD Suppressors 4-CH; PartNumber: TPD4E05U06; Value: TPD4E05U06
IC4 = FT2232D: Dual USB-UART/FIFO; Value: FT2232D; PartNumber: FT2232D
IC5 = NCP380HSNAJAAT1G: POWER LOAD SWITCH, HIGH SIDE; PartNumber: NCP380HSNAJAAT1G; Value: NCP380HSNAJAAT1G
IC6 = HD3SS3220: IC DRP PORT CTLR USB-C 30WQFN; PartNumber: HD3SS3220; Value: HD3SS3220
IC9 = PTN5150: CC logic for USB Type-C applications; PartNumber: PTN5150; Value: PTN5150
J6 J9 = CON-Molex-47346-0001: USB - micro B Receptacle Connector 5 Position Surface Mount, Right Angle, Horizontal; PartNumber: 47346-0001; Value: 47346-0001
J7 = CON-Molex-105450-0101: USB-C connector; PartNumber: CON-Molex-105450-0101; Value: 105450-0101
L8 L11 = 742792022: WURTH ELEKTRONIK - 742792022 - FERRITE BEAD, 0.05OHM, 2A, 0805; Value: 742792022; Manufacturer: WURTH ELEKTRONIK; PartNumber: 742792022
L9 = BLM18SG121TN1D: FERRITE BEAD, 0.025OHM, 3A, 0603; Manufacturer: MURATA; PartNumber: BLM18EG221SN1D; Value: BLM18SG121TN1D
L10 = BLM18EG221SN1D: MURATA 	BLM18EG221SN1D  FERRITE BEAD, 0.05OHM, 2A, 0603; Value: BLM18EG221SN1D; Manufacturer: MURATA; PartNumber: BLM18EG221SN1D
L12 = BLM18SG121TN1D: FERRITE BEAD, 0.025OHM, 3A, 0603; Manufacturer: MURATA; Value: BLM18SG121TN1D; PartNumber: BLM18SG121TN1D
LED1 = LED_R: LED Red 0603 case; Manufacturer: KINGBRIGHT; Value: KPT-1608EC; PartNumber: KPT-1608EC
Q2 = PMV32UP: P CH, 20V, 4A; Manufacturer: NXP; PartNumber: PMV32UP; Value: PMV32UP
R68 = R_470R_0402: SMT Resistor 470R 0402; PartNumber: R_470R_0402; Value: 470R
R69 = R_0R_0603: SMT Resistor 0R 0603; Value: 0R; PartNumber: R_0R_0603
R70 = R_470R_0603: SMT Resistor 470R 0603; Value: 470R; PartNumber: R_470R_0603
R71 R72 R76 R77 R83-R85 R98 R127-R129 R132-R138 = R_0R_0402: SMT Resistor 0402; PartNumber: R_0R_0402; Value: 0R
R73 = R_5k6_0603: SMT Resistor 5k6 0603; PartNumber: R_5k6_0603; Value: 5k6
R74 R78 = R_200k_0402: SMT Resistor 200k 0402; PartNumber: R_200k_0402; Value: 200k
R75 = R_909k_0402: SMT Resistor 9k31 0402; PartNumber: R_909k_0402; Value: 909k
R79 R80 = R_2k2_0402: RES, 2k2, 0402, 5%; PartNumber: R_2k2_0402; Value: 2k2
R81 R87 R101 R116 R121-R123 R126 = R_10k_0402: SMT Resistor 0402; PartNumber: R_10k_0402; Value: 10k
R82 R86 = R_4k7_0402: SMT Resistor 4k7 0402; PartNumber: R_4k7_0402; Value: 4k7
R100 = R_1k54_0402: SMT Resistor 1k54 0402; PartNumber: R_1k54_0402; Value: 1k54
R117 = R_100k_0402: SMT Resistor 100k 0402; PartNumber: R_100k_0402; Value: 100k
R124 R125 = R_5k11_0402: SMT Resistor 5k11 0402; PartNumber: R_5k11_0402; Value: 5k11
TP6-TP8 = TP-R-1.5: Testpad, round, 1.5mm; PartNumber: Testpad
Y2 = CRYSTAL_6_MHz_SMD: CRYSTAL, 6MHZ, 12PF, SMD,30ppm; Manufacturer: MERCURY UNITED ELECTRONICS; Value: MQ-6.000-12-30/30/; PartNumber: CRYSTAL_6_MHz_SMD

## Nets that join several sheets
+1V8: Ethernet (9 pins), M2 (R112.2), SoM (R67.2), Supply (C68.2 R99.2)
+3V3: CSI (6 pins), Interfaces (12 pins), M2 (11 pins), SoM (R48.2), USB-Debug (11 pins)
+3V3_PHY: Ethernet (7 pins), SoM (R50.2 R53.2), Supply (C67.2 IC8.1 IC8.3 R49.2)
+5V0_OTG: SoM (R97.2), USB-Debug (L11.2 R128.2)
+5V0_SW: CSI (J1.49 J1.50), Interfaces (5 pins), SoM (F1.1), Supply (FAN1.1 FAN2.1 R56.2), USB-Debug (13 pins)
GND: CSI (6 pins), Ethernet (34 pins), Interfaces (20 pins), M2 (18 pins), SoM (88 pins), Supply (32 pins), USB-Debug (47 pins)
USBC_VBUS: SoM (R47.1), USB-Debug (8 pins)
C_TMDS_HEAC: Interfaces (C84.2), SoM (JM3.80)
C_TMDS_HPD: Interfaces (C85.2), SoM (JM3.82)
CAM0_SCL: CSI (J1.40 R3.2), SoM (JM1.87)
CAM0_SDA: CSI (J1.39 R4.2), SoM (JM1.85)
CAM1_SCL: CSI (J1.42 R1.2), SoM (JM1.83), USB-Debug (IC9.8)
CAM1_SDA: CSI (J1.41 R2.2), SoM (JM1.81), USB-Debug (IC9.7)
CSI_1_CLK_N: CSI (J1.28), SoM (JM1.16)
CSI_1_CLK_P: CSI (J1.29), SoM (JM1.18)
CSI_1_D0_N: CSI (J1.25), SoM (JM1.10)
CSI_1_D0_P: CSI (J1.26), SoM (JM1.12)
CSI_1_D1_N: CSI (J1.23), SoM (JM1.21)
CSI_1_D1_P: CSI (J1.24), SoM (JM1.23)
CSI_1_D2_N: CSI (J1.21), SoM (JM1.4)
CSI_1_D2_P: CSI (J1.22), SoM (JM1.6)
CSI_1_D3_N: CSI (J1.19), SoM (JM1.27)
CSI_1_D3_P: CSI (J1.20), SoM (JM1.29)
CSI_2_CLK_N: CSI (J1.10), SoM (JM1.34)
CSI_2_CLK_P: CSI (J1.11), SoM (JM1.36)
CSI_2_D0_N: CSI (J1.7), SoM (JM1.33)
CSI_2_D0_P: CSI (J1.8), SoM (JM1.35)
CSI_2_D1_N: CSI (J1.5), SoM (JM1.28)
CSI_2_D1_P: CSI (J1.6), SoM (JM1.30)
CSI_2_D2_N: CSI (J1.3), SoM (JM1.22)
CSI_2_D2_P: CSI (J1.4), SoM (JM1.24)
CSI_2_D3_N: CSI (J1.1), SoM (JM1.39)
CSI_2_D3_P: CSI (J1.2), SoM (JM1.41)
ENET_MDC: Ethernet (R39.2), SoM (JM0.11)
ENET_MDIO: Ethernet (R41.2), SoM (JM0.9)
ENET_nINT: Ethernet (R16.1 R21.2 R43.2), SoM (JM3.39)
ENET_nRST: Ethernet (R44.1 R46.2), SoM (JM3.43)
ENET_RD0: Ethernet (R35.1), SoM (JM0.33)
ENET_RD1: Ethernet (R36.1), SoM (JM0.35)
ENET_RD2: Ethernet (R38.1), SoM (JM0.31)
ENET_RD3: Ethernet (R40.1), SoM (JM0.37)
ENET_RD_CTL: Ethernet (R42.1), SoM (JM0.29)
ENET_RXC: Ethernet (R34.1), SoM (JM0.27)
ENET_TD0: Ethernet (R28.1), SoM (JM0.19)
ENET_TD1: Ethernet (R29.1), SoM (JM0.21)
ENET_TD2: Ethernet (R30.1), SoM (JM0.17)
ENET_TD3: Ethernet (R32.1), SoM (JM0.15)
ENET_TD_CTL: Ethernet (R33.1), SoM (JM0.13)
ENET_TXC: Ethernet (R27.1), SoM (JM0.23)
HDMI_REFCLK_N: Interfaces (C83.2 R104.2 R106.2), SoM (JM0.60)
HDMI_REFCLK_P: Interfaces (C82.2 R103.2 R105.2), SoM (JM0.58)
NAND_ALE: SoM (JM0.16), USB-Debug (IC9.6 R126.1)
OTG_ID: SoM (R130.2), USB-Debug (IC9.9 R123.1)
PCIE1_nRST: M2 (R111.1), SoM (JM0.59)
PCIE1_nWAKE: M2 (R108.1), SoM (JM0.61)
PCIE1_REF_CLK_N: M2 (R109.2), SoM (JM0.55)
PCIE1_REF_CLK_P: M2 (R107.2), SoM (JM0.53)
PCIE1_RX_N: M2 (C74.2), SoM (JM0.49)
PCIE1_RX_P: M2 (C73.2), SoM (JM0.47)
PCIE1_TX_N: M2 (C72.2), SoM (JM0.41)
PCIE1_TX_P: M2 (C71.2), SoM (JM0.43)
SDIO_CD#: Interfaces (J5.9 R60.1), SoM (JM0.24)
SDIO_CLK: Interfaces (D4.11 J5.5 R63.1), SoM (JM0.48)
SDIO_CMD: Interfaces (D4.12 J5.3 R64.1), SoM (JM0.26)
SDIO_D0: Interfaces (D4.9 J5.7 R62.1), SoM (JM0.28)
SDIO_D1: Interfaces (D4.8 J5.8 R61.1), SoM (JM0.32)
SDIO_D2: Interfaces (D4.14 J5.1 R66.1), SoM (JM0.34)
SDIO_D3: Interfaces (D4.13 J5.2 R65.1), SoM (JM0.38)
TMDS_CLK_N: Interfaces (C64.1), SoM (JM3.70)
TMDS_CLK_P: Interfaces (C62.1), SoM (JM3.68)
TMDS_D0_N: Interfaces (C63.1), SoM (JM3.73)
TMDS_D0_P: Interfaces (C60.1), SoM (JM3.75)
TMDS_D1_N: Interfaces (C61.1), SoM (JM3.81)
TMDS_D1_P: Interfaces (C59.1), SoM (JM3.79)
TMDS_D2_N: Interfaces (C58.1), SoM (JM3.74)
TMDS_D2_P: Interfaces (C57.1), SoM (JM3.76)
TMDS_HPD: Interfaces (C85.1 J8.19 R115.2), SoM (JM3.89)
TMDS_SCL_5V: Interfaces (J8.15 R118.1), SoM (JM3.87)
TMDS_SDA_5V: Interfaces (J8.16 R119.1), SoM (JM3.85)
UART3_RXD: SoM (JM1.97), USB-Debug (IC4.40)
UART3_TXD: SoM (JM1.91), USB-Debug (IC4.39)
USB2_N: SoM (JM1.65), USB-Debug (D8.2 J7.A7 J7.B7)
USB2_P: SoM (JM1.63), USB-Debug (D8.1 J7.A6 J7.B6)
USB_OTG_N: SoM (JM1.53), USB-Debug (D2.1 J9.2)
USB_OTG_P: SoM (JM1.51), USB-Debug (D2.2 J9.3)
USBSS_RX_N: SoM (JM1.72), USB-Debug (R136.1)
USBSS_RX_P: SoM (JM1.70), USB-Debug (R135.1)
USBSS_TX_N: SoM (JM1.71), USB-Debug (R133.1)
USBSS_TX_P: SoM (JM1.69), USB-Debug (R98.1)
UUSB_DEBUG_RX: SoM (JM1.95), USB-Debug (IC4.24)
UUSB_DEBUG_TXD: SoM (JM1.93), USB-Debug (IC4.23)

## Assembly variants
Prototype: not fitted R5 R11 R12 R13 R14 R15 R17 R18 R21 R24 R54 R69 R72 R81 R85